# Altium project Genio350_DevKit.PrjPcb (part 3 of 3)

## Sheet AU.SchDoc
size A3; SheetNumber: 23; SheetTotal: 35
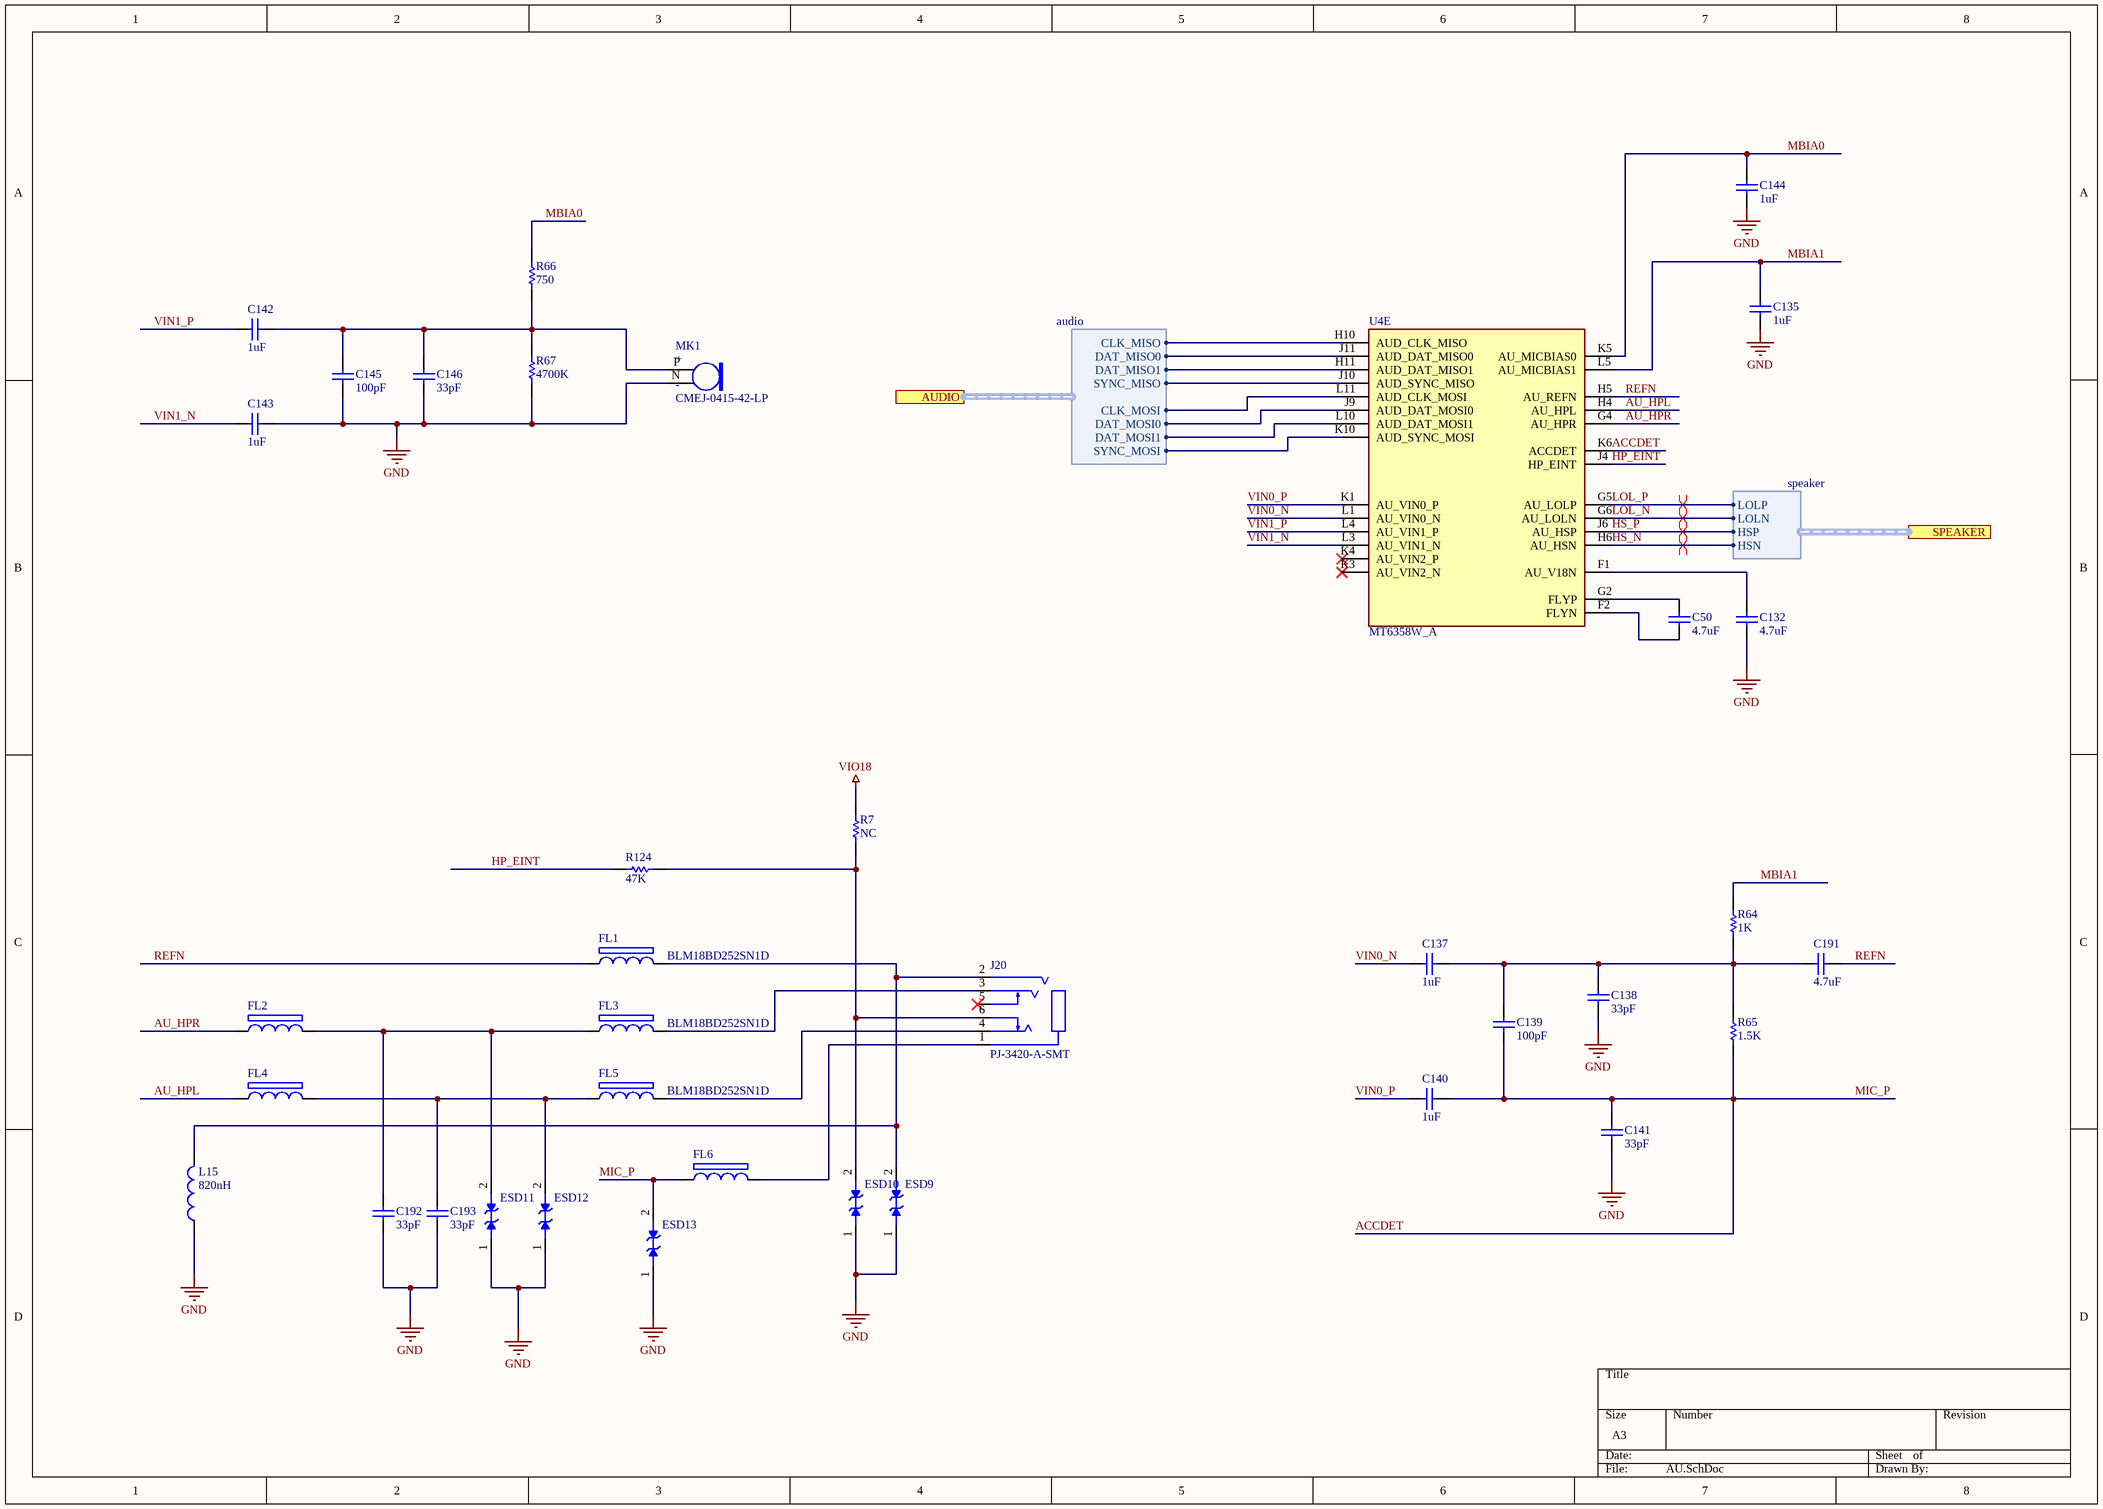
[diagram p25: AU.SchDoc]

### Parts
C50  value 4.7uF  [C0805]  (hidden comment: C0805)
C132  value 4.7uF  [C0805]  (hidden comment: C0805)
C135  value 1uF  [C0805]  (hidden comment: C0805)
C137  value 1uF  [C0805]  (hidden comment: C0805)
C138  value 33pF  [C0402]  (hidden comment: C0402)
C139  value 100pF  [C0402]  (hidden comment: C0402)
C140  value 1uF  [C0805]  (hidden comment: C0805)
C141  value 33pF  [C0402]  (hidden comment: C0402)
C142  value 1uF  [C0805]  (hidden comment: C0805)
C143  value 1uF  [C0805]  (hidden comment: C0805)
C144  value 1uF  [C0805]  (hidden comment: C0805)
C145  value 100pF  [C0402]  (hidden comment: C0402)
C146  value 33pF  [C0402]  (hidden comment: C0402)
C191  value 4.7uF  [C0805]  (hidden comment: C0805)
C192  value 33pF  [C0402]  (hidden comment: C0402)
C193  value 33pF  [C0402]  (hidden comment: C0402)
ESD9  ESD9B5.0ST5G  [SODFL1006X40N]  (value not drawn)
ESD10  ESD9B5.0ST5G  [SODFL1006X40N]  (value not drawn)
ESD11  ESD9B5.0ST5G  [SODFL1006X40N]  (value not drawn)
ESD12  ESD9B5.0ST5G  [SODFL1006X40N]  (value not drawn)
ESD13  ESD9B5.0ST5G  [SODFL1006X40N]  (value not drawn)
FL1  BLM18BD252SN1D  [BEADC1608X95N]
FL2  BLM18BD252SN1D  [BEADC1608X95N]  (value not drawn)
FL3  BLM18BD252SN1D  [BEADC1608X95N]
FL4  BLM18BD252SN1D  [BEADC1608X95N]  (value not drawn)
FL5  BLM18BD252SN1D  [BEADC1608X95N]
FL6  BLM18BD252SN1D  [BEADC1608X95N]  (value not drawn)
J20  PJ-3420-A-SMT  [PJ3420ASMT]
L15  value 820nH  [L0603]  (hidden comment: L0603)
MK1  CMEJ-0415-42-LP  [MIC_CMEJ-0415-42-LP]
R7  value NC  [R0603]  (hidden comment: R0603)
R64  value 1K  [R0603]  (hidden comment: R0603)
R65  value 1.5K  [R0603]  (hidden comment: R0603)
R66  value 750  [R0603]  (hidden comment: R0603)
R67  value 4700K  [R0603]  (hidden comment: R0603)
R124  value 47K  [R0603]  (hidden comment: R0603)
U4  MT6358W_A  [BGA194C40P16X15_640X600X66]  (part E of 6)

### Ports
AUDIO (harness audio, see Power[5400,5000], MT8365[10000,5800], MT8365_AUD[2500,6000], Power[5400,3900]), SPEAKER (harness speaker, see Power[5800,5000], AUDIO_AMP[397.796,3600], Power[5800,3800])

### Harnesses
audio: CLK_MISO, DAT_MISO0, DAT_MISO1, SYNC_MISO, CLK_MOSI, DAT_MOSI0, DAT_MOSI1, SYNC_MOSI
speaker: LOLP, LOLN, HSP, HSN

### Nets
GND: C132.2 C135.2 C138.1 C141.1 C143.1 C144.2 C145.1 C146.1 C192.1 C193.1 ESD9.1(A) ESD10.1(A) ESD11.1(A) ESD12.1(A) ESD13.1(A) L15.1 MK1.N(GND) R67.1
VIO18: R7.2
ACCDET: C139.1 C140.1 C141.2 ESD13.2(A1) FL6.1 R65.1 U4.K6(ACCDET)  [also labelled MIC_P]
AU_HPL: FL4.1 U4.H4(AU_HPL)
AU_HPR: FL2.1 U4.G4(AU_HPR)
HP_EINT: R124.1 U4.J4(HP_EINT)
HS_N: U4.H6(AU_HSN) ; port SPEAKER.HSN
HS_P: U4.J6(AU_HSP) ; port SPEAKER.HSP
LOL_N: U4.G6(AU_LOLN) ; port SPEAKER.LOLN
LOL_P: U4.G5(AU_LOLP) ; port SPEAKER.LOLP
MBIA0: C144.1 R66.2 U4.K5(AU_MICBIAS0)
MBIA1: C135.1 R64.2 U4.L5(AU_MICBIAS1)
REFN: C191.1 FL1.1 U4.H5(AU_REFN)
VIN0_N: C137.2 U4.L1(AU_VIN0_N)
VIN0_P: C140.2 U4.K1(AU_VIN0_P)
VIN1_N: C143.2 U4.L3(AU_VIN1_N)
VIN1_P: C142.2 U4.L4(AU_VIN1_P)
NetC50_1: C50.1 U4.G2(FLYP)
NetC50_2: C50.2 U4.F2(FLYN)
NetC132_1: C132.1 U4.F1(AU_V18N)
NetC137_1: C137.1 C138.2 C139.2 C191.2 R64.1 R65.2
NetC142_1: C142.1 C145.2 C146.2 MK1.P(OUTPUT) R66.1 R67.2
NetC192_2: C192.2 ESD11.2(A1) FL2.2 FL3.1
NetC193_2: C193.2 ESD12.2(A1) FL4.2 FL5.1
NetESD9_2: ESD9.2(A1) FL1.2 J20.2 L15.2
NetESD10_2: ESD10.2(A1) J20.6 R7.1 R124.2
NetFL3_2: FL3.2 J20.3
NetFL5_2: FL5.2 J20.4
NetFL6_2: FL6.2 J20.1
NetU1#1_AA26: U4.J9(AUD_DAT_MOSI0) ; port AUDIO.DAT_MOSI0
NetU1#1_AA29: U4.J10(AUD_SYNC_MISO) ; port AUDIO.SYNC_MISO
NetU1#1_AB29: U4.H11(AUD_DAT_MISO1) ; port AUDIO.DAT_MISO1
NetU1#1_W26: U4.L10(AUD_DAT_MOSI1) ; port AUDIO.DAT_MOSI1
NetU1#1_Y26: U4.L11(AUD_CLK_MOSI) ; port AUDIO.CLK_MOSI
NetU1#1_Y27: U4.K10(AUD_SYNC_MOSI) ; port AUDIO.SYNC_MOSI
NetU1#1_Y29: U4.J11(AUD_DAT_MISO0) ; port AUDIO.DAT_MISO0
NetU1#1_Y30: U4.H10(AUD_CLK_MISO) ; port AUDIO.CLK_MISO

Not connected (* = marked no-connect by the designer): J20 5(4)*; U4 K3(AU_VIN2_N)* K4(AU_VIN2_P)*

### Layout directives
differential pair: HS_N, HS_P, LOL_N, LOL_P

### Notes on the sheet
- (in symbol CMEJ-0415-42-LP) +; -

### Library data of the parts
ESD9-ESD13 = ESD9B5.0ST5G: as ESD5 on sheet UART
FL1-FL6 = BLM18BD252SN1D: Inductor Chip Bead 2.5KOhm 25% 100MHz Ferrite 50mA 0603
J20 = PJ-3420-A-SMT: Connector; Manufacturer_Name: XKB Connectivity; Datasheet Link: http://www.helloxkb.com/public/images/pdf/PJ-3420-X-SMT.pdf; Height: 4.5mm; Manufacturer_Part_Number: PJ-3420-A-SMT
MK1 = CMEJ-0415-42-LP: 4.0 mm, Omnidirectional, PCB Mount, 2.0 Vdc, Elecret Condenser Microphone
U4 = MT6358W_A: PMIC; Manufacturer_Name: Mediatek; Manufacturer_Part_Number: MT6358W/A; Datasheet Link: https://www.mouser.com/catalog/specsheets/MediaTek_MTK_MT6358_Product_Brief_v1_0.pdf?_gl=1*14yevt7*_ga*OTAyMjU2NDU3LjE2ODExMDUyMzk.*_ga_1KQLCYKRX3*MTcwODA1NjU3MS4xMTcuMC4xNzA4MDU2NTczLjAuMC4w*_ga_15W4STQT4T*MTcwODA1NjU3Mi4xNzIuMC4xNzA4MDU2NTczLjU5LjAuMA..; Height: 0.66mm; Mouser Part Number: 840-MT6358W/A; Mouser Price/Stock: https://www.mouser.co.uk/ProductDetail/MediaTek/MT6358W-A?qs=Jm2GQyTW%2FbiK3FZkyfX0lQ%3D%3D

## Sheet RTC_Miscellaneous.SchDoc
size A4; SheetNumber: 24; SheetTotal: 36
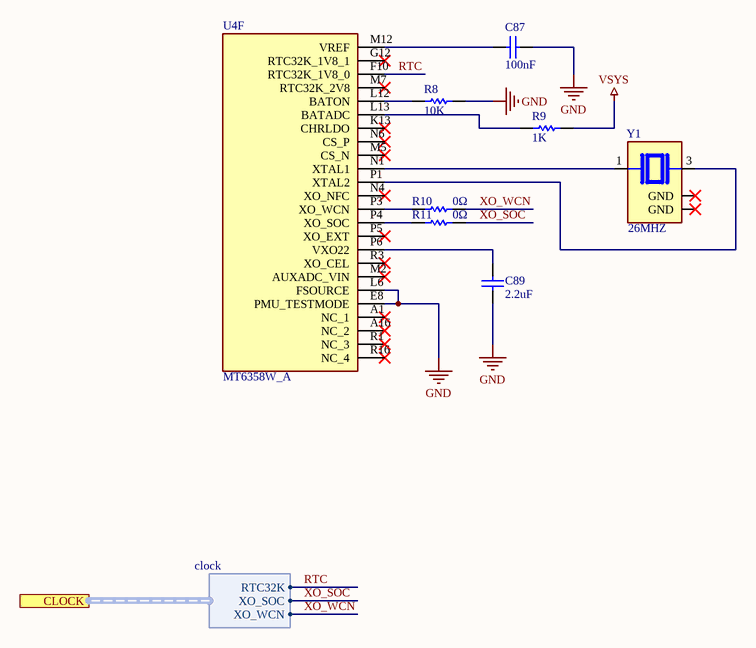
[diagram p26: RTC_Miscellaneous.SchDoc]

### Parts
C87  value 100nF  [C0603]  (hidden comment: C0603)
C89  value 2.2uF  [C0805]  (hidden comment: C0805)
R8  value 10K  [R0603]  (hidden comment: R0603)
R9  value 1K  [R0603]  (hidden comment: R0603)
R10  value 0Ω  [R0603]  (hidden comment: R0603)
R11  value 0Ω  [R0603]  (hidden comment: R0603)
U4  MT6358W_A  [BGA194C40P16X15_640X600X66]  (part F of 6)
Y1  26MHZ  [OSCCC320X250X90N]

### Ports
CLOCK (harness clock, see Power[10000,5700], MT8365[11000,4500], MT8365_Other[1500,5800], Power[11000,5700])

### Harnesses
clock: RTC32K, XO_SOC, XO_WCN

### Nets
GND: C87.1 C89.1 R8.2 U4.E8(PMU_TESTMODE) U4.L6(FSOURCE)
VSYS: R9.2
RTC: U4.F10(RTC32K_1V8_0) ; port CLOCK.RTC32K
XO_SOC: R11.2 ; port CLOCK.XO_SOC  [project net 26M_CLKSQ]
XO_WCN: R10.2 ; port CLOCK.XO_WCN  [project net XO_IN]
NetC87_2: C87.2 U4.M12(VREF)
NetC89_2: C89.2 U4.P6(VXO22)
NetR8_1: R8.1 U4.L12(BATON)
NetR9_1: R9.1 U4.L13(BATADC)
NetR10_1: R10.1 U4.P3(XO_WCN)
NetR11_1: R11.1 U4.P4(XO_SOC)
NetU4_N1: U4.N1(XTAL1) Y1.1
NetU4_P1: U4.P1(XTAL2) Y1.3

Not connected (* = marked no-connect by the designer): U4 A1(NC_1)* A16(NC_2)* G12(RTC32K_1V8_1)* K13(CHRLDO)* M2(AUXADC_VIN)* M5(CS_N)* M7(RTC32K_2V8)* N4(XO_NFC)* N6(CS_P)* P5(XO_EXT)* R1(NC_3)* R3(XO_CEL)* R16(NC_4)*; Y1 2(GND)* 4(GND)*

### Library data of the parts
U4 = MT6358W_A: as U4 on sheet AU; Datasheet Link: https://www.mouser.com/catalog/specsheets/MediaTek_MTK_MT6358_Product_Brief_v1_0.pdf?_gl=1*14yevt7*_ga*OTAyMjU2NDU3LjE2ODExMDUyMzk.*_ga_1KQLCYKRX3*MTcwODA1NjU3MS4xMTcuMC4xNzA4MDU2NTczLjAuMC4w*_ga_15W4STQT4T*MTcwODA1NjU3Mi4xNzIuMC4xNzA4MDU2NTczLjU5LjAuMA..; Height: 0.66mm; Mouser Part Number: 840-MT6358W/A; Mouser Price/Stock: https://www.mouser.co.uk/ProductDetail/MediaTek/MT6358W-A?qs=Jm2GQyTW%2FbiK3FZkyfX0lQ%3D%3D
Y1 = NX3225GA-26MHZ-TI

## Sheet Control_Interface.SchDoc
size A4; SheetNumber: 22; SheetTotal: 36
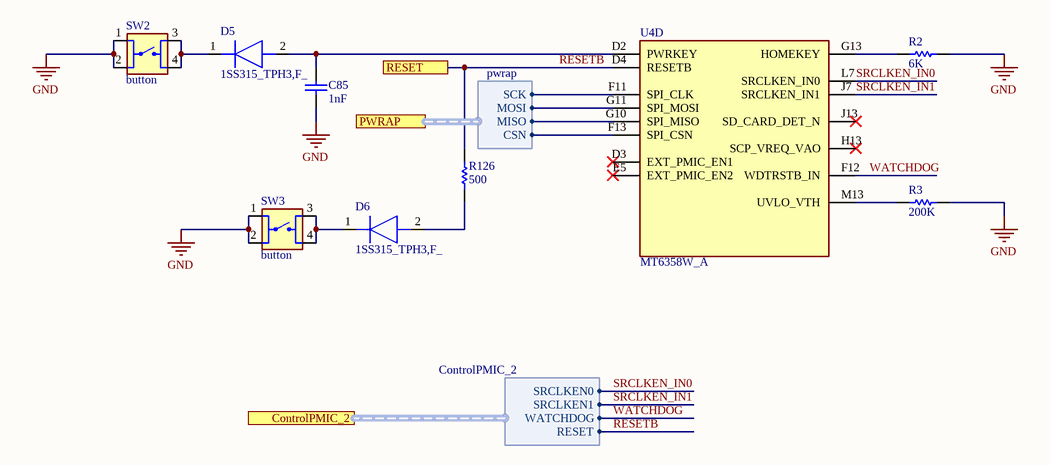
[diagram p27: Control_Interface.SchDoc]

### Parts
C85  value 1nF  [C0603]  (hidden comment: C0603)
D5  1SS315_TPH3,F_  [SOD2513X110N]
D6  1SS315_TPH3,F_  [SOD2513X110N]
R2  value 6K  [R0603]  (hidden comment: R0603)
R3  value 200K  [R0603]  (hidden comment: R0603)
R126  value 500  [R0603]  (hidden comment: R0603)
SW2  button  [BUTTON]
SW3  button  [BUTTON]
U4  MT6358W_A  [BGA194C40P16X15_640X600X66]  (part D of 6)

### Ports
ControlPMIC_2 (harness ControlPMIC_2, see Power[9700,8000], MT8365[11000,4800], MT8365_Other[1000,3700], Power[9700,9000]), PWRAP (harness pwrap, see Power[9100,8000], MT8365[5500,9000], MT8365_CONN[4500,8700], Power[9100,9000]), RESET (see Power[10000,7100], Power[11300,7100], RTL8201F[12800,5800], UART[1500,3000])

### Harnesses
pwrap: SCK, MOSI, MISO, CSN
ControlPMIC_2: WATCHDOG, SRCLKEN0, SRCLKEN1, RESET

### Nets
GND: C85.1 R2.2 R3.2 SW2.1 SW2.2 SW3.1 SW3.2
RESETB: R126.2 U4.D4(RESETB) ; port RESET, port ControlPMIC_2.RESET  [project net reset]
SRCLKEN_IN0: U4.L7(SRCLKEN_IN0) ; port ControlPMIC_2.SRCLKEN0
SRCLKEN_IN1: U4.J7(SRCLKEN_IN1) ; port ControlPMIC_2.SRCLKEN1
WATCHDOG: U4.F12(WDTRSTB_IN) ; port ControlPMIC_2.WATCHDOG
NetC85_2: C85.2 D5.2(A) U4.D2(PWRKEY)
NetD5_1: D5.1(K) SW2.3 SW2.4
NetD6_1: D6.1(K) SW3.3 SW3.4
NetD6_2: D6.2(A) R126.1
NetR2_1: R2.1 U4.G13(HOMEKEY)
NetR3_1: R3.1 U4.M13(UVLO_VTH)
NetU1#2_AC27: U4.G10(SPI_MISO) ; port PWRAP.MISO
NetU1#2_AD27: U4.F11(SPI_CLK) ; port PWRAP.SCK
NetU1#2_AD28: U4.F13(SPI_CSN) ; port PWRAP.CSN
NetU1#2_AE28: U4.G11(SPI_MOSI) ; port PWRAP.MOSI

Not connected (* = marked no-connect by the designer): U4 D3(EXT_PMIC_EN1)* E5(EXT_PMIC_EN2)* H13(SCP_VREQ_VAO)* J13(SD_CARD_DET_N)*

### Library data of the parts
D5 D6 = 1SS315_TPH3,F_: Diode; Manufacturer_Name: Toshiba; Manufacturer_Part_Number: 1SS315(TPH3,F); Height: 1.1mm; Mouser Part Number: N/A; Mouser Price/Stock: https://www.mouser.co.uk/ProductDetail/Toshiba/1SS315TPH3F?qs=8TQFHmocP6xxNvZUFM2DpA%3D%3D
SW2 SW3 = button: 6x6 mm
U4 = MT6358W_A: Integrated Circuit; Manufacturer_Name: Mediatek; Manufacturer_Part_Number: MT6358W/A; Datasheet Link: https://www.mouser.com/catalog/specsheets/MediaTek_MTK_MT6358_Product_Brief_v1_0.pdf?_gl=1*14yevt7*_ga*OTAyMjU2NDU3LjE2ODExMDUyMzk.*_ga_1KQLCYKRX3*MTcwODA1NjU3MS4xMTcuMC4xNzA4MDU2NTczLjAuMC4w*_ga_15W4STQT4T*MTcwODA1NjU3Mi4xNzIuMC4xNzA4MDU2NTczLjU5LjAuMA..; Height: 0.66mm; Mouser Part Number: 840-MT6358W/A; Mouser Price/Stock: https://www.mouser.co.uk/ProductDetail/MediaTek/MT6358W-A?qs=Jm2GQyTW%2FbiK3FZkyfX0lQ%3D%3D

## Sheet Charger_boost_LDO.SchDoc
size A3; SheetNumber: 25; SheetTotal: 35
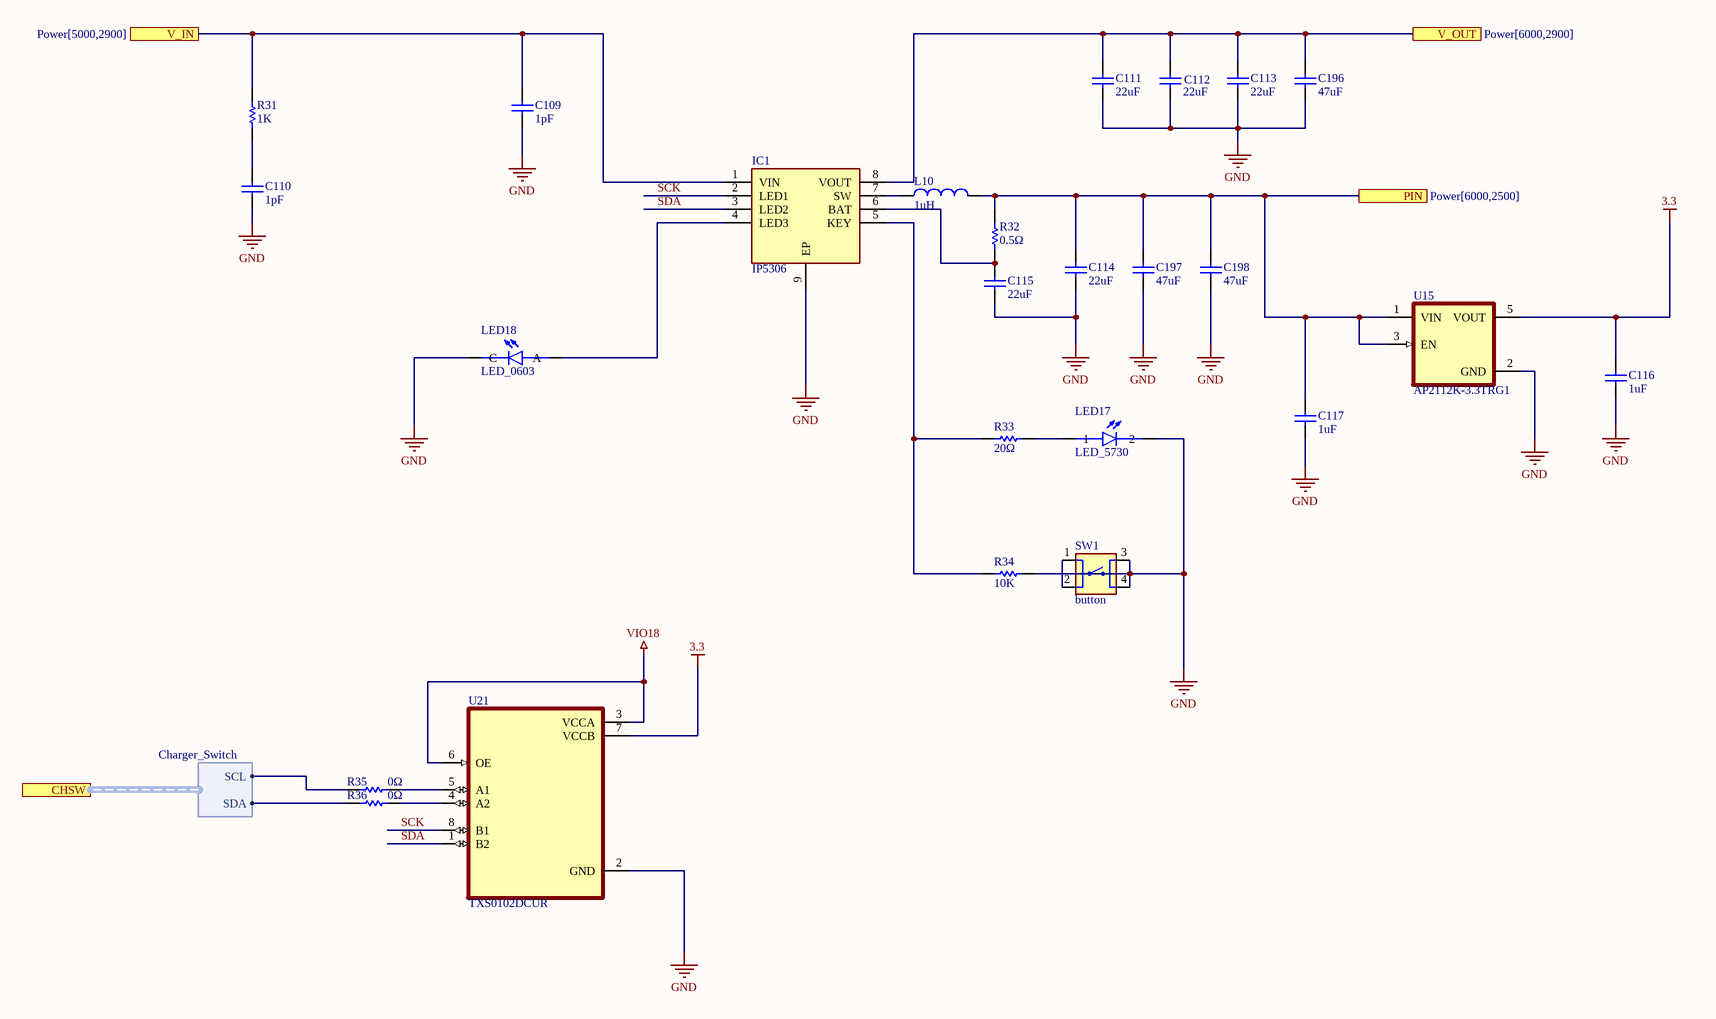
[diagram p28: Charger_boost_LDO.SchDoc]

### Parts
C109  value 1pF  [C0402]  (hidden comment: C0402)
C110  value 1pF  [C0402]  (hidden comment: C0402)
C111  value 22uF  [C1210]  (hidden comment: C1210)
C112  value 22uF  [C1210]  (hidden comment: C1210)
C113  value 22uF  [C1210]  (hidden comment: C1210)
C114  value 22uF  [C1210]  (hidden comment: C1210)
C115  value 22uF  [C1210]  (hidden comment: C1210)
C116  value 1uF  [C0805]  (hidden comment: C0805)
C117  value 1uF  [C0805]  (hidden comment: C0805)
C196  value 47uF  [C1812]  (hidden comment: C1812)
C197  value 47uF  [C1812]  (hidden comment: C1812)
C198  value 47uF  [C1812]  (hidden comment: C1812)
IC1  IP5306  [SOIC127P600X165-9N]
L10  value 1uH  [L0806]  (hidden comment: L0806)
LED17  LED_5730  [SM5730UWDC05]
LED18  LED_0603  [LED_0603]
R31  value 1K  [R0603]  (hidden comment: R0603)
R32  value 0.5Ω  [R1210]  (hidden comment: R1210)
R33  value 20Ω  [R1206]  (hidden comment: R1206)
R34  value 10K  [R0603]  (hidden comment: R0603)
R35  value 0Ω  [R0603]  (hidden comment: R0603)
R36  value 0Ω  [R0603]  (hidden comment: R0603)
SW1  button  [BUTTON]
U15  AP2112K-3.3TRG1  [SOT95P285X140-5N]
U21  TXS0102DCUR  [SOP50P310X90-8N]

### Ports
CHSW (harness Charger_Switch, see Power[5300,2200], I2C_Switch[500,7800], Power[5300,500]), PIN (see Power[6000,2500]), V_IN (see Power[5000,2900]), V_OUT (see Power[6000,2900])

### Harnesses
Charger_Switch: SCL, SDA

### Nets
3.3: C116.2 U15.5(VOUT) U21.7(VCCB)
+5: C111.2 C112.2 C113.2 C196.2 IC1.8(VOUT) ; port V_OUT
GND: C109.1 C110.1 C111.1 C112.1 C113.1 C114.1 C115.1 C116.1 C117.1 C196.1 C197.1 C198.1 IC1.9(EP) LED17.2 LED18.C R34.2 SW1.3 SW1.4 U15.2(GND) U21.2(GND)
VIO18: U21.3(VCCA) U21.6(OE)
VSYS: C114.2 C117.2 C197.2 C198.2 L10.2 R32.2 U15.1(VIN) U15.3(EN) ; port PIN
SCK: IC1.2(LED1) U21.8(B1)
SDA: IC1.3(LED2) U21.1(B2)
NetC109_2: C109.2 IC1.1(VIN) R31.2 ; port V_IN
NetC110_2: C110.2 R31.1
NetC115_2: C115.2 IC1.6(BAT) R32.1
NetIC1_4: IC1.4(LED3) LED18.A
NetIC1_5: IC1.5(KEY) R33.1 R34.1
NetIC1_7: IC1.7(SW) L10.1
NetLED17_1: LED17.1 R33.2
NetR35_1: R35.1 ; port CHSW.SCL
NetR35_2: R35.2 U21.5(A1)
NetR36_1: R36.1 ; port CHSW.SDA
NetR36_2: R36.2 U21.4(A2)
NetSW1_1: SW1.1 SW1.2

### Library data of the parts
IC1 = IP5306: Integrated Circuit; Manufacturer_Name: INJOINIC; Datasheet Link: https://datasheetspdf.com/pdf-file/1139129/Injoinic/IP5306/1; Height: 1.65mm; Manufacturer_Part_Number: IP5306
L10 = L0806: Inductor / SMD:1.6x2mm
LED17 = LED_5730: LED SMD; Manufacturer_Name: Bivar; Datasheet Link: https://ja-bots.com/wp-content/uploads/2023/01/SM5730UWDC05-BIVAR.pdf?srsltid=AfmBOoovMyML2SIj8QvW33aYphKHuiK9c7G9KYdJdHNR0r_sEcANN2ud; Height: 1.154mm; Manufacturer_Part_Number: SM5730UWDC05; Mouser Part Number: 749-SM5730UWDC05; Mouser Price/Stock: https://www.mouser.co.uk/ProductDetail/Bivar/SM5730UWDC05?qs=R6DaRWE8nmu0EcNcbYsDPw%3D%3D; Arrow Part Number: SM5730UWDC05; Arrow Price/Stock: https://www.arrow.com/en/products/sm5730uwdc05/bivar?region=nac
LED18 = LED_0603: LED SMD
SW1 = button: 6x6 mm
U15 = AP2112K-3.3TRG1: Linear Voltage Regulator IC Positive Fixed 1 Output 600mA SOT-25
U21 = TXS0102DCUR: chuyển mức tín hiệu I2C

## Sheet Camera.SchDoc
size A3; Author: Nguyễn Hữu Thắng; DrawnBy: Nguyễn Hữu Thắng; SheetNumber: 30; SheetTotal: 35
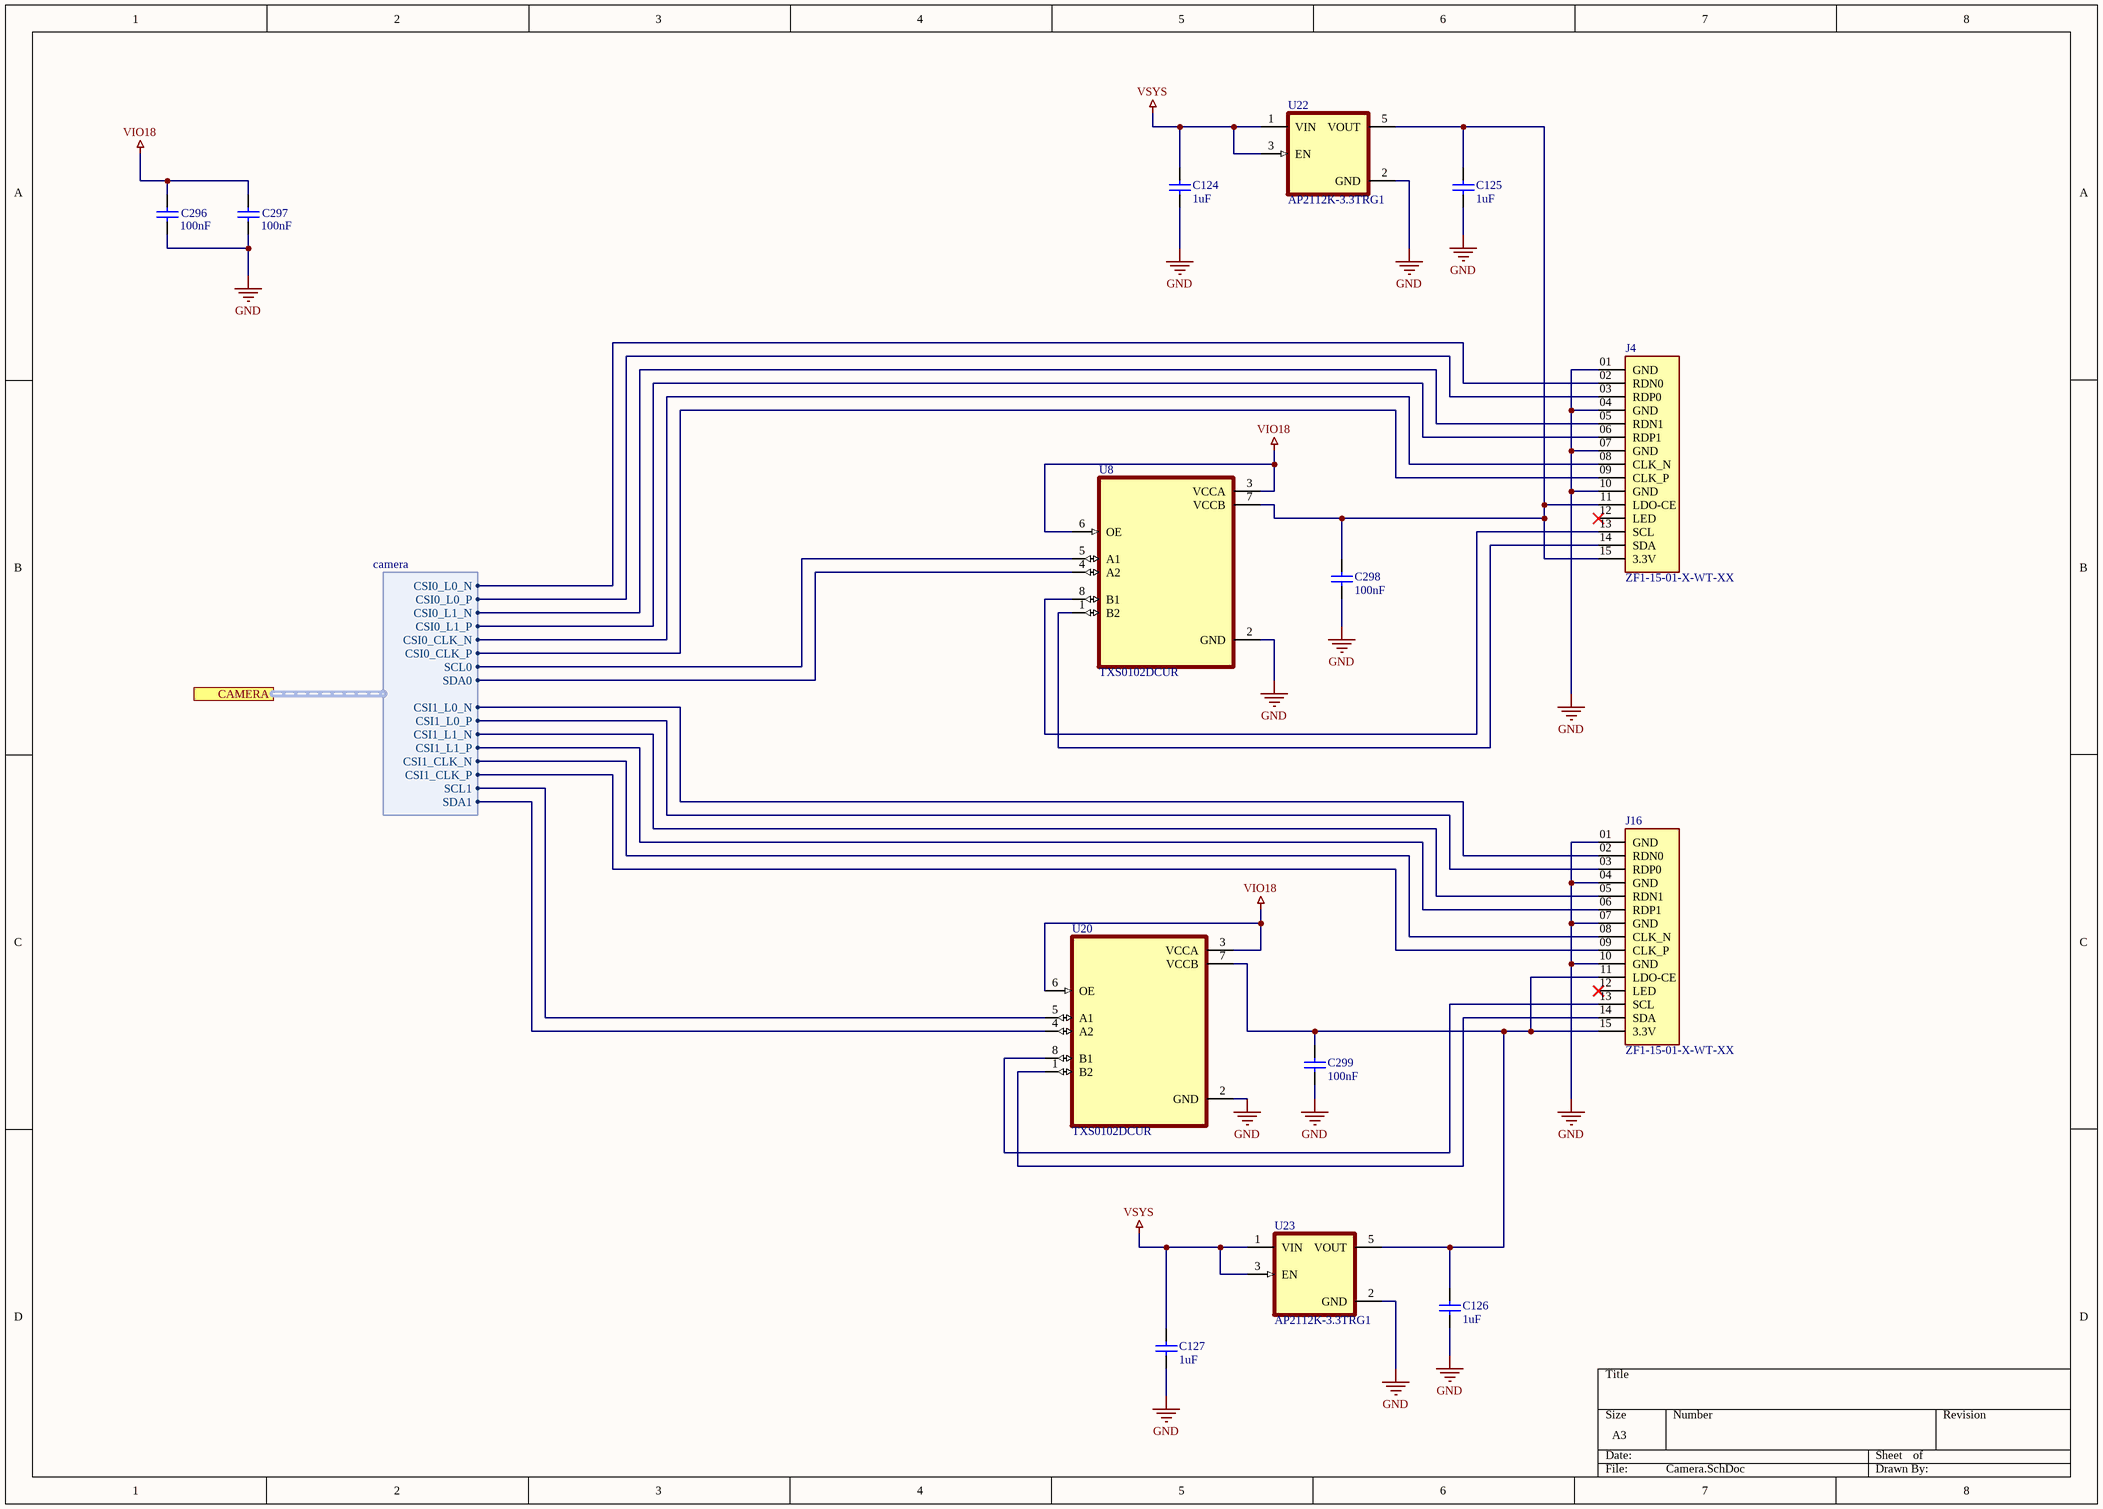
[diagram p29: Camera.SchDoc]

### Parts
C124  value 1uF  [C0805]  (hidden comment: C0805)
C125  value 1uF  [C0805]  (hidden comment: C0805)
C126  value 1uF  [C0805]  (hidden comment: C0805)
C127  value 1uF  [C0805]  (hidden comment: C0805)
C296  value 100nF  [C0603]  (hidden comment: C0603)
C297  value 100nF  [C0603]  (hidden comment: C0603)
C298  value 100nF  [C0603]  (hidden comment: C0603)
C299  value 100nF  [C0603]  (hidden comment: C0603)
J4  ZF1-15-01-X-WT-XX  [SAMTEC_ZF1-15-01-X-WT-XX]
J16  ZF1-15-01-X-WT-XX  [SAMTEC_ZF1-15-01-X-WT-XX]
U8  TXS0102DCUR  [SOP50P310X90-8N]
U20  TXS0102DCUR  [SOP50P310X90-8N]
U22  AP2112K-3.3TRG1  [SOT95P285X140-5N]
U23  AP2112K-3.3TRG1  [SOT95P285X140-5N]

### Ports
CAMERA (harness camera, see main[4000,5400], MT8365[10400,6600], MT8365_Camera[2400,4000])

### Harnesses
camera: CSI0_L0_P, CSI0_L0_N, CSI0_L1_P, CSI0_L1_N, CSI0_CLK_P, CSI0_CLK_N, CSI1_L0_P, CSI1_L0_N, CSI1_L1_P, CSI1_L1_N, CSI1_CLK_P, CSI1_CLK_N, SCL0, SDA0, SCL1, SDA1

### Nets
GND: C124.1 C125.1 C126.1 C127.1 C296.1 C297.1 C298.1 C299.1 J4.01(GND) J4.04(GND) J4.07(GND) J4.10(GND) J16.01(GND) J16.04(GND) J16.07(GND) J16.10(GND) U8.2(GND) U20.2(GND) U22.2(GND) U23.2(GND)
VIO18: C296.2 C297.2 U8.3(VCCA) U8.6(OE) U20.3(VCCA) U20.6(OE)
VSYS: C124.2 C127.2 U22.1(VIN) U22.3(EN) U23.1(VIN) U23.3(EN)
27: U20.4(A2) ; port CAMERA.SDA1
28: U20.5(A1) ; port CAMERA.SCL1
CSI0_CLK_N: J4.08(CLK_N) ; port CAMERA.CSI0_CLK_N
CSI0_CLK_P: J4.09(CLK_P) ; port CAMERA.CSI0_CLK_P
CSI0_L0_N: J4.02(RDN0) ; port CAMERA.CSI0_L0_N
CSI0_L0_P: J4.03(RDP0) ; port CAMERA.CSI0_L0_P
CSI0_L1_N: J4.05(RDN1) ; port CAMERA.CSI0_L1_N
CSI0_L1_P: J4.06(RDP1) ; port CAMERA.CSI0_L1_P
CSI1_CLK_N: J16.08(CLK_N) ; port CAMERA.CSI1_CLK_N
CSI1_CLK_P: J16.09(CLK_P) ; port CAMERA.CSI1_CLK_P
CSI1_L0_N: J16.02(RDN0) ; port CAMERA.CSI1_L0_N
CSI1_L0_P: J16.03(RDP0) ; port CAMERA.CSI1_L0_P
CSI1_L1_N: J16.05(RDN1) ; port CAMERA.CSI1_L1_N
CSI1_L1_P: J16.06(RDP1) ; port CAMERA.CSI1_L1_P
NetC125_2: C125.2 C298.2 J4.11(LDO-CE) J4.15(3.3V) U8.7(VCCB) U22.5(VOUT)
NetC126_2: C126.2 C299.2 J16.11(LDO-CE) J16.15(3.3V) U20.7(VCCB) U23.5(VOUT)
NetJ4_13: J4.13(SCL) U8.8(B1)
NetJ4_14: J4.14(SDA) U8.1(B2)
NetJ16_13: J16.13(SCL) U20.8(B1)
NetJ16_14: J16.14(SDA) U20.1(B2)
NetU1#2_AH4: U8.5(A1) ; port CAMERA.SCL0
NetU1#2_AJ4: U8.4(A2) ; port CAMERA.SDA0

Not connected (* = marked no-connect by the designer): J4 12(LED)*; J16 12(LED)*

### Library data of the parts
U22 U23 = AP2112K-3.3TRG1: as U15 on sheet Charger_boost_LDO

## Sheet USB.SchDoc
size A4; Author: Nguyễn Hữu Thắng; DrawnBy: Nguyễn Hữu Thắng; SheetNumber: 28; SheetTotal: 36
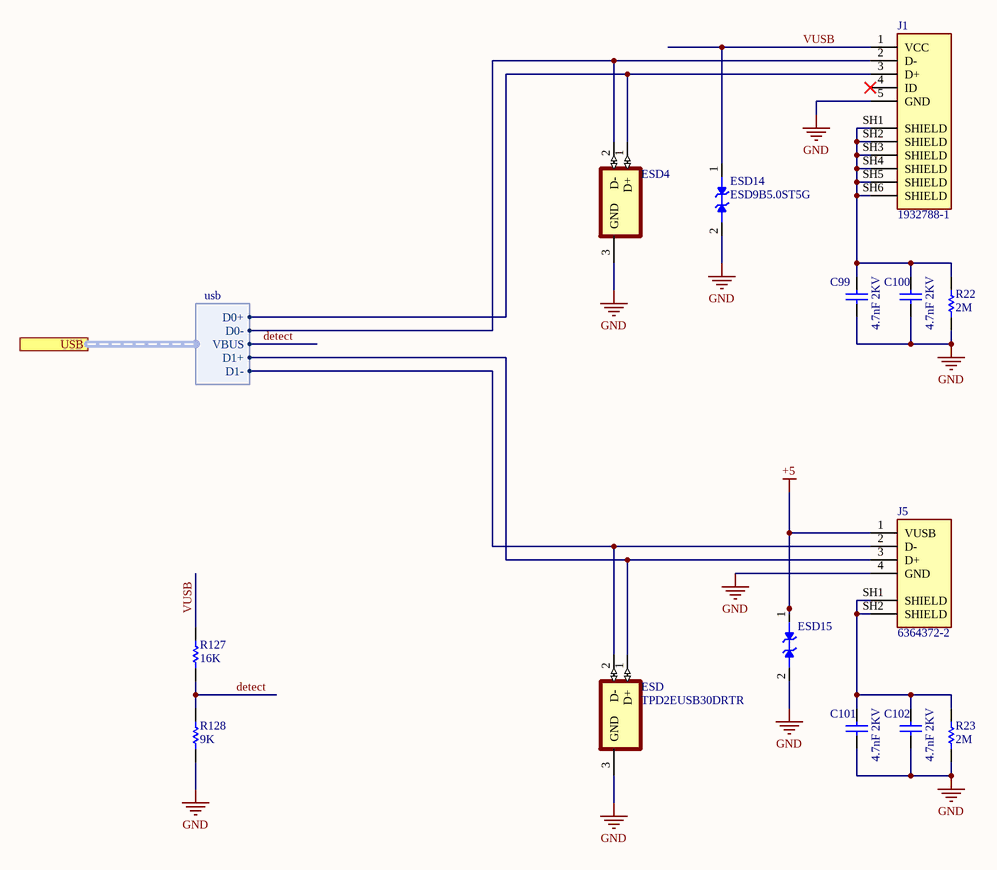
[diagram p30: USB.SchDoc]

### Parts
C99  value 4.7nF 2KV  [C1210]  (hidden comment: C1210)
C100  value 4.7nF 2KV  [C1210]  (hidden comment: C1210)
C101  value 4.7nF 2KV  [C1210]  (hidden comment: C1210)
C102  value 4.7nF 2KV  [C1210]  (hidden comment: C1210)
ESD  TPD2EUSB30DRTR  [SOTFL35P100X50-3N]
ESD4  TPD2EUSB30DRTR  [SOTFL35P100X50-3N]  (value not drawn)
ESD14  ESD9B5.0ST5G  [SODFL1006X40N]
ESD15  ESD9B5.0ST5G  [SODFL1006X40N]  (value not drawn)
J1  1932788-1  [TE_1932788-1]
J5  6364372-2  [TE_6364372-2]
R22  value 2M  [R0603]  (hidden comment: R0603)
R23  value 2M  [R0603]  (hidden comment: R0603)
R127  value 16K  [R0603]  (hidden comment: R0603)
R128  value 9K  [R0603]  (hidden comment: R0603)

### Ports
USB (harness usb, see main[9000,4700], MT8365[6600,9000], MT8365_CONN[2500,5900])

### Harnesses
usb: D0+, D0-, D1+, D1-, VBUS

### Nets
+5: ESD15.1(A) J5.1(VUSB)
GND: C99.1 C100.1 C101.1 C102.1 ESD.3(GND) ESD4.3(GND) ESD14.2(A1) ESD15.2(A1) J1.5(GND) J5.4(GND) R22.2 R23.2 R128.1
detect: R127.1 R128.2 ; port USB.VBUS
USB0_N: ESD4.2(D-) J1.2(D-) ; port USB.D0-
USB0_P: ESD4.1(D+) J1.3(D+) ; port USB.D0+
USB1_N: ESD.2(D-) J5.2(D-) ; port USB.D1-
USB1_P: ESD.1(D+) J5.3(D+) ; port USB.D1+
VUSB: ESD14.1(A) J1.1(VCC) R127.2
NetC99_2: C99.2 C100.2 J1.SH1(SHIELD) J1.SH2(SHIELD) J1.SH3(SHIELD) J1.SH4(SHIELD) J1.SH5(SHIELD) J1.SH6(SHIELD) R22.1
NetC101_2: C101.2 C102.2 J5.SH1(SHIELD) J5.SH2(SHIELD) R23.1

Not connected (* = marked no-connect by the designer): J1 4(ID)*

### Library data of the parts
ESD ESD4 = TPD2EUSB30DRTR: 2-channel ESD solution for SuperSpeed USB 3.0 interface 3-SOT-9X3 -40 to 85
ESD14 ESD15 = ESD9B5.0ST5G: Clamp Ipp Tvs Diode Surface Mount SOD-923

## Sheet GPIOs.SchDoc
size A3; Author: Nguyễn Hữu Thắng; DrawnBy: Nguyễn Hữu Thắng; SheetNumber: 32; SheetTotal: 35
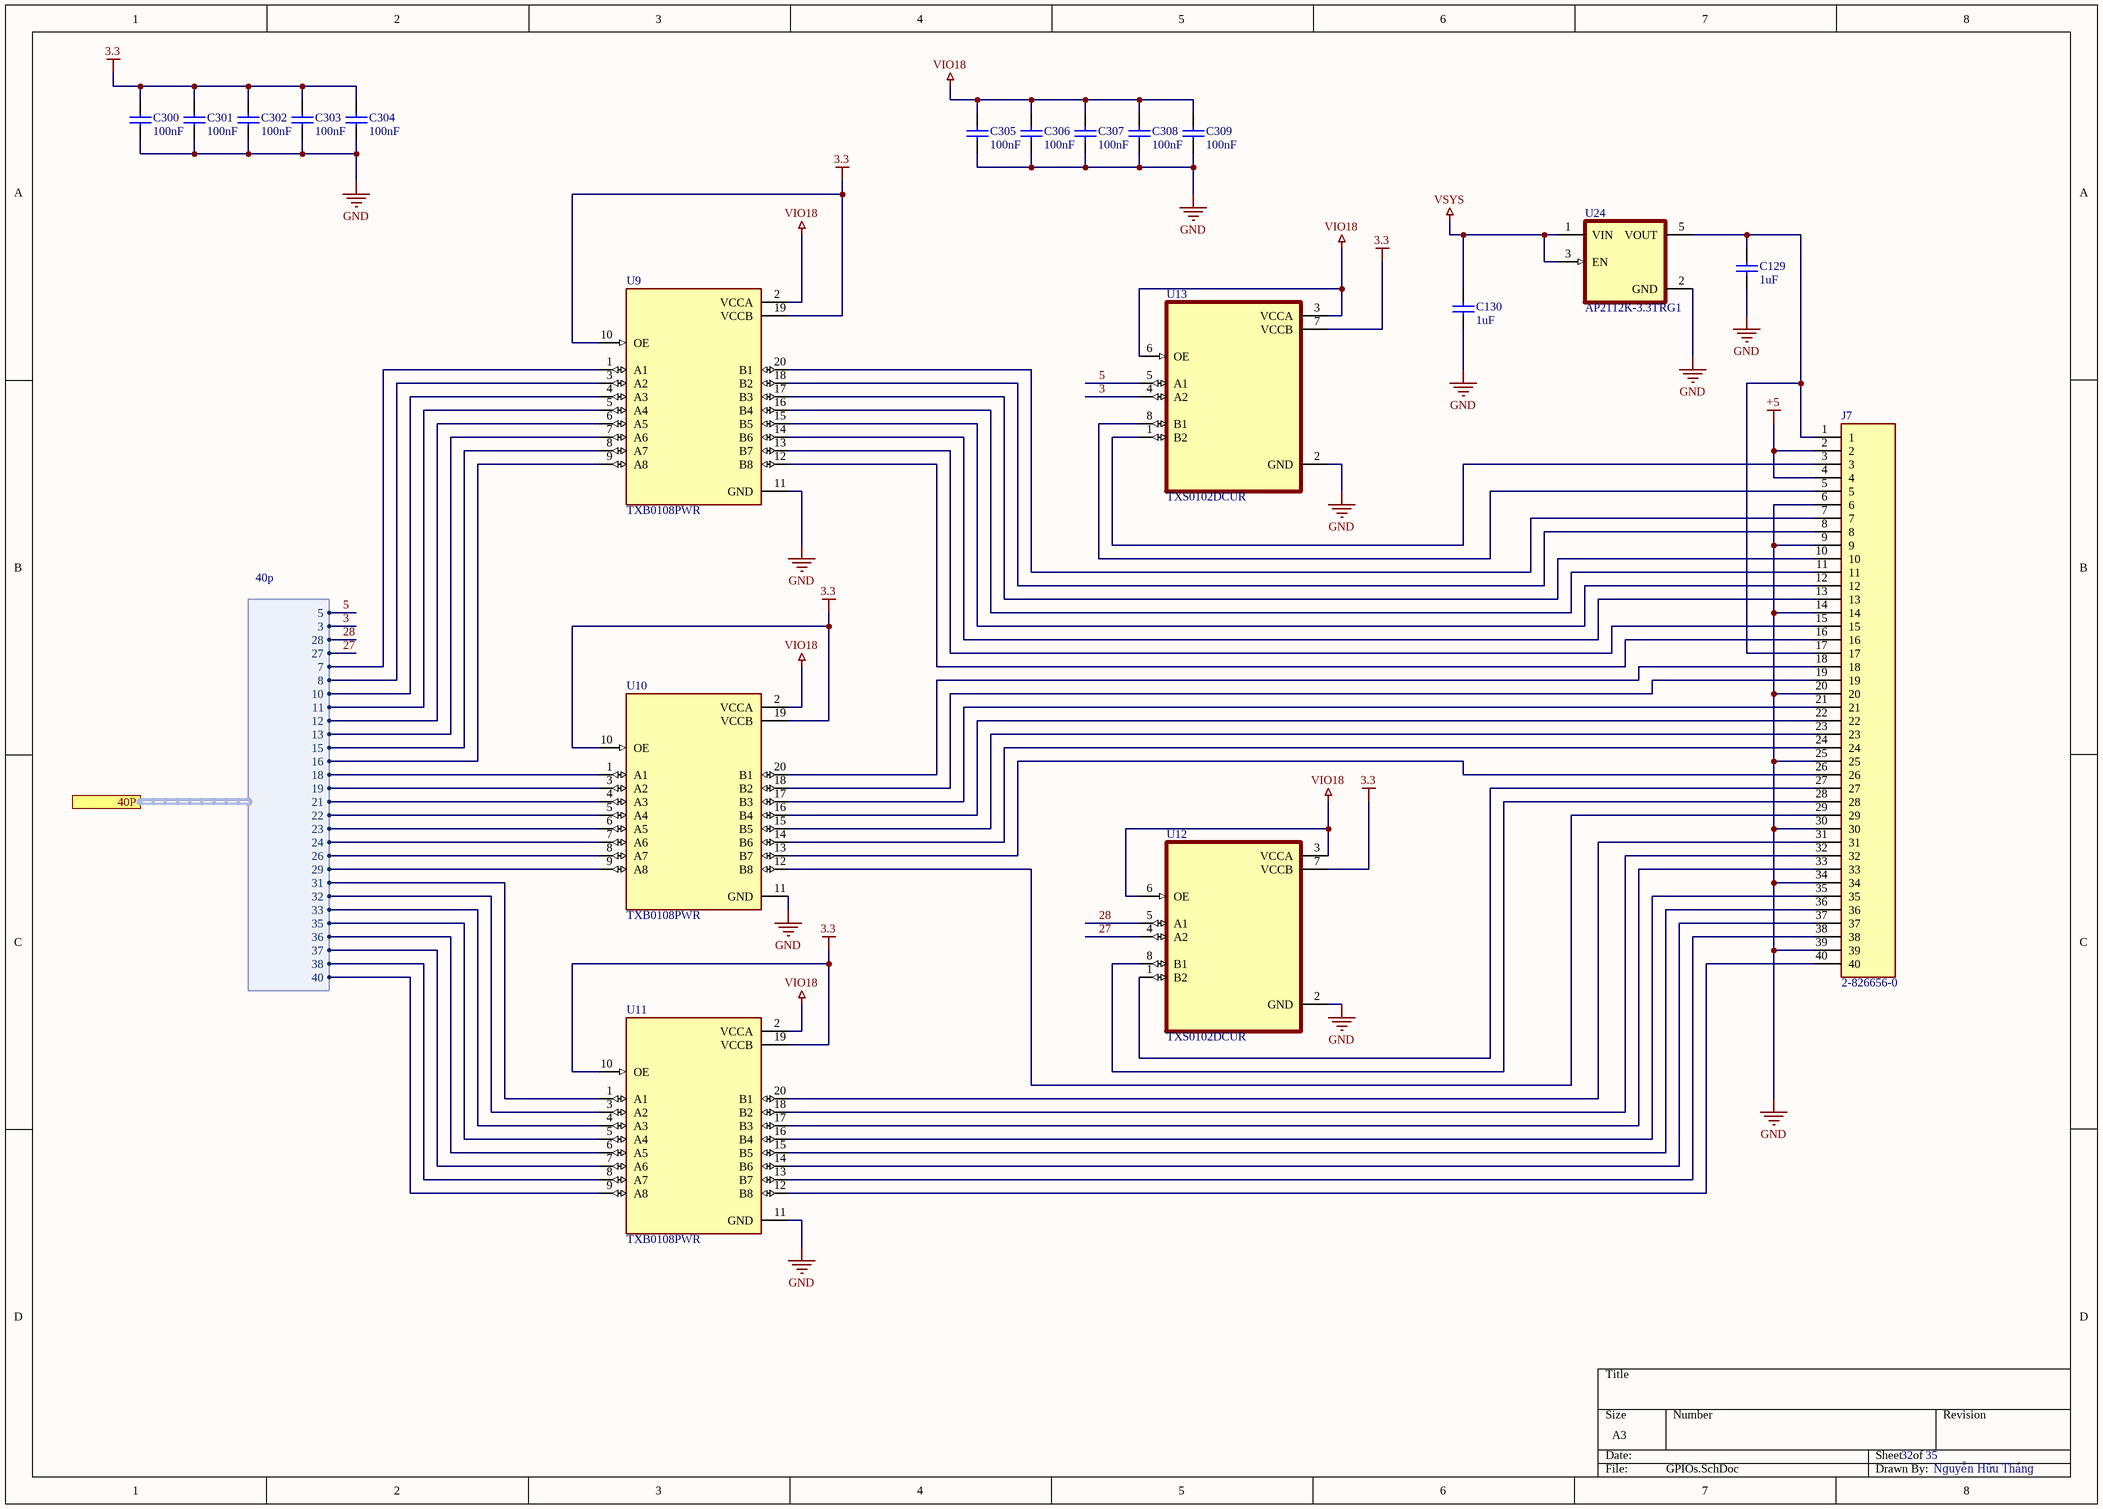
[diagram p31: GPIOs.SchDoc]

### Parts
C129  value 1uF  [C0805]  (hidden comment: C0805)
C130  value 1uF  [C0805]  (hidden comment: C0805)
C300  value 100nF  [C0603]  (hidden comment: C0603)
C301  value 100nF  [C0603]  (hidden comment: C0603)
C302  value 100nF  [C0603]  (hidden comment: C0603)
C303  value 100nF  [C0603]  (hidden comment: C0603)
C304  value 100nF  [C0603]  (hidden comment: C0603)
C305  value 100nF  [C0603]  (hidden comment: C0603)
C306  value 100nF  [C0603]  (hidden comment: C0603)
C307  value 100nF  [C0603]  (hidden comment: C0603)
C308  value 100nF  [C0603]  (hidden comment: C0603)
C309  value 100nF  [C0603]  (hidden comment: C0603)
J7  2-826656-0  [TE_2-826656-0]
U9  TXB0108PWR  [SOP65P640X120-20N]
U10  TXB0108PWR  [SOP65P640X120-20N]
U11  TXB0108PWR  [SOP65P640X120-20N]
U12  TXS0102DCUR  [SOP50P310X90-8N]
U13  TXS0102DCUR  [SOP50P310X90-8N]
U24  AP2112K-3.3TRG1  [SOT95P285X140-5N]

### Ports
40P (harness 40p, see main[6000,4000], MT8365[4600,3000], MT8365[7500,8900], MT8365[10000,5500], MT8365_AUD[3500,5200], MT8365_CONN[10500,3000], MT8365_eMMC[8900,5600])

### Harnesses
40p: 7, 8, 10, 11, 12, 13, 15, 16, 18, 19, 21, 22, 23, 24, 26, 29, 32, 35, 36, 37, 38, 40, 33, 31, 5, 3, 28, 27

### Nets
3.3: C300.2 C301.2 C302.2 C303.2 C304.2 U9.10(OE) U9.19(VCCB) U10.10(OE) U10.19(VCCB) U11.10(OE) U11.19(VCCB) U12.7(VCCB) U13.7(VCCB)
+5: J7.2 J7.4
GND: C129.1 C130.1 C300.1 C301.1 C302.1 C303.1 C304.1 C305.1 C306.1 C307.1 C308.1 C309.1 J7.6 J7.9 J7.14 J7.20 J7.25 J7.30 J7.34 J7.39 U9.11(GND) U10.11(GND) U11.11(GND) U12.2(GND) U13.2(GND) U24.2(GND)
VIO18: C305.2 C306.2 C307.2 C308.2 C309.2 U9.2(VCCA) U10.2(VCCA) U11.2(VCCA) U12.3(VCCA) U12.6(OE) U13.3(VCCA) U13.6(OE)
VSYS: C130.2 U24.1(VIN) U24.3(EN)
3: U13.4(A2) ; port 40P.3
5: U13.5(A1) ; port 40P.5
27: U12.4(A2) ; port 40P.27
28: U12.5(A1) ; port 40P.28
CK: U10.6(A5) ; port 40P.23
CS: U10.7(A6) ; port 40P.24
GPIO10: U9.1(A1) ; port 40P.7
GPIO13: U9.5(A4) ; port 40P.11
KPCOL0: U10.8(A7) ; port 40P.26
KPCOL1: U10.9(A8) ; port 40P.29
KPROW0: U11.6(A5) ; port 40P.36
KPROW1: U11.7(A6) ; port 40P.37
MI: U10.4(A3) ; port 40P.21
MO: U10.3(A2) ; port 40P.19
PWM_C: U11.3(A2) ; port 40P.32
URXD2: U9.4(A3) ; port 40P.10
UTXD2: U9.3(A2) ; port 40P.8
NetC129_2: C129.2 J7.1 J7.17 U24.5(VOUT)
NetJ7_3: J7.3 U13.1(B2)
NetJ7_5: J7.5 U13.8(B1)
NetJ7_7: J7.7 U9.20(B1)
NetJ7_8: J7.8 U9.18(B2)
NetJ7_10: J7.10 U9.17(B3)
NetJ7_11: J7.11 U9.16(B4)
NetJ7_12: J7.12 U9.15(B5)
NetJ7_13: J7.13 U9.14(B6)
NetJ7_15: J7.15 U9.13(B7)
NetJ7_16: J7.16 U9.12(B8)
NetJ7_18: J7.18 U10.20(B1)
NetJ7_19: J7.19 U10.18(B2)
NetJ7_21: J7.21 U10.17(B3)
NetJ7_22: J7.22 U10.16(B4)
NetJ7_23: J7.23 U10.15(B5)
NetJ7_24: J7.24 U10.14(B6)
NetJ7_26: J7.26 U10.13(B7)
NetJ7_27: J7.27 U12.1(B2)
NetJ7_28: J7.28 U12.8(B1)
NetJ7_29: J7.29 U10.12(B8)
NetJ7_31: J7.31 U11.20(B1)
NetJ7_32: J7.32 U11.18(B2)
NetJ7_33: J7.33 U11.17(B3)
NetJ7_35: J7.35 U11.16(B4)
NetJ7_36: J7.36 U11.15(B5)
NetJ7_37: J7.37 U11.14(B6)
NetJ7_38: J7.38 U11.13(B7)
NetJ7_40: J7.40 U11.12(B8)
NetU1#1_AB13: U9.6(A5) ; port 40P.12
NetU1#1_AB14: U11.5(A4) ; port 40P.35
NetU1#1_AC14: U11.9(A8) ; port 40P.40
NetU1#1_AD14: U11.8(A7) ; port 40P.38
NetU1#2_AC13: U11.4(A3) ; port 40P.33
NetU1#2_AD13: U9.9(A8) ; port 40P.16
NetU1#2_AE13: U10.5(A4) ; port 40P.22
NetU1#2_AE14: U11.1(A1) ; port 40P.31
NetU1#2_AF12: U10.1(A1) ; port 40P.18
NetU1#2_AF13: U9.8(A7) ; port 40P.15
NetU1#2_AF14: U9.7(A6) ; port 40P.13

### Library data of the parts
U24 = AP2112K-3.3TRG1: Linear Voltage Regulator IC Positive Fixed 1 Output 600mA SOT-25

## Sheet Display.SchDoc
size A4; SheetNumber: 33; SheetTotal: 36
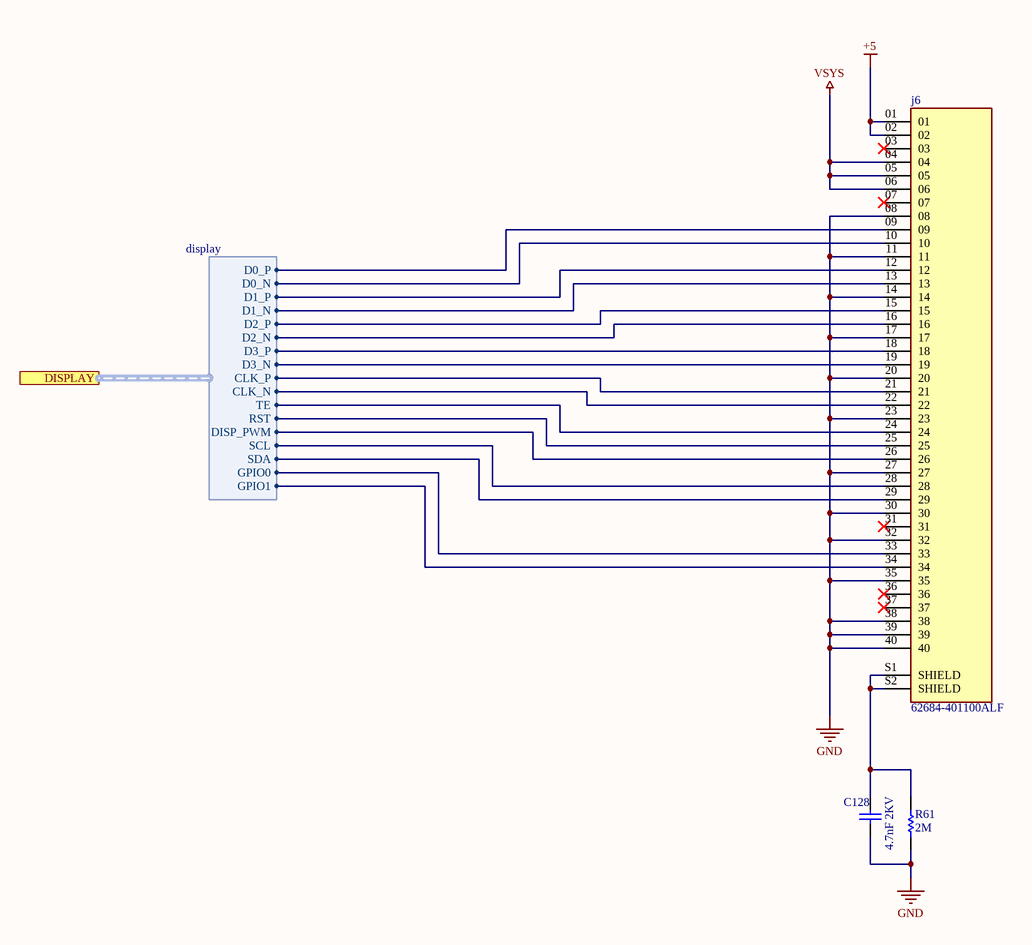
[diagram p32: Display.SchDoc]

### Parts
C128  value 4.7nF 2KV  [C1210]  (hidden comment: C1210)
j6  62684-401100ALF  [AMPHENOL_62684-401100ALF]
R61  value 2M  [R0603]  (hidden comment: R0603)

### Ports
DISPLAY (harness display, see main[9100,8000], MT8365[6900,9000], MT8365_CONN[1400,3100])

### Harnesses
display: D0_P, D0_N, D1_P, D1_N, D2_P, D2_N, D3_P, D3_N, CLK_P, CLK_N, TE, RST, DISP_PWM, SCL, SDA, GPIO0, GPIO1

### Nets
+5: j6.01 j6.02
GND: C128.1 j6.08 j6.11 j6.14 j6.17 j6.20 j6.23 j6.27 j6.30 j6.32 j6.35 j6.38 j6.39 j6.40 R61.2
VSYS: j6.04 j6.05 j6.06
3: j6.29 ; port DISPLAY.SDA
5: j6.28 ; port DISPLAY.SCL
DSI_CK_N: j6.22 ; port DISPLAY.CLK_N
DSI_CK_P: j6.21 ; port DISPLAY.CLK_P
DSI_D0_N: j6.10 ; port DISPLAY.D0_N
DSI_D0_P: j6.09 ; port DISPLAY.D0_P
DSI_D1_N: j6.13 ; port DISPLAY.D1_N
DSI_D1_P: j6.12 ; port DISPLAY.D1_P
DSI_D2_N: j6.16 ; port DISPLAY.D2_N
DSI_D2_P: j6.15 ; port DISPLAY.D2_P
DSI_D3_N: j6.19 ; port DISPLAY.D3_N
DSI_D3_P: j6.18 ; port DISPLAY.D3_P
GPIO17: j6.33 ; port DISPLAY.GPIO0
GPIO18: j6.34 ; port DISPLAY.GPIO1
NetC128_2: C128.2 j6.S1(SHIELD) j6.S2(SHIELD) R61.1
Netj6_24: j6.24 ; port DISPLAY.TE
Netj6_25: j6.25 ; port DISPLAY.RST
Netj6_26: j6.26 ; port DISPLAY.DISP_PWM

Not connected (* = marked no-connect by the designer): j6 03* 07* 31* 36* 37*

## Sheet AUDIO_AMP.SchDoc
size A4; SheetNumber: 34; SheetTotal: 35
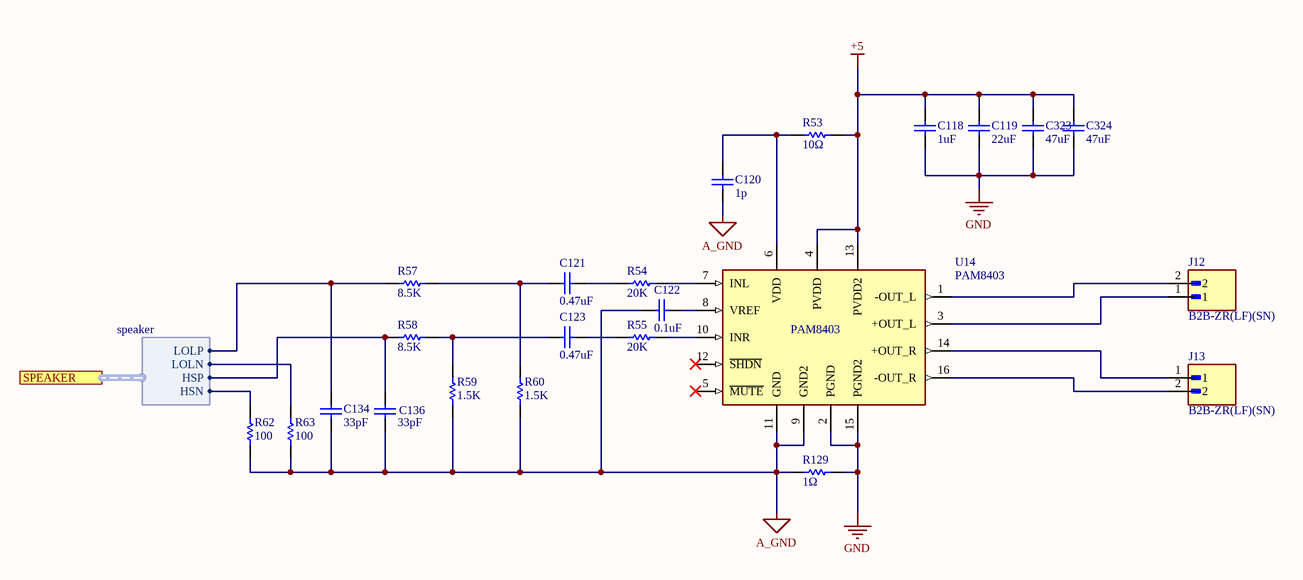
[diagram p33: AUDIO_AMP.SchDoc]

### Parts
C118  value 1uF  [C0805]  (hidden comment: C0805)
C119  value 22uF  [C1210]  (hidden comment: C1210)
C120  value 1p  [C0402]  (hidden comment: C0402)
C121  value 0.47uF  [C0603]  (hidden comment: C0603)
C122  value 0.1uF  [C0603]  (hidden comment: C0603)
C123  value 0.47uF  [C0603]  (hidden comment: C0603)
C134  value 33pF  [C0402]  (hidden comment: C0402)
C136  value 33pF  [C0402]  (hidden comment: C0402)
C323  value 47uF  [C1812]  (hidden comment: C1812)
C324  value 47uF  [C1812]  (hidden comment: C1812)
J12  B2B-ZR(LF)(SN)  [JST_B2B-ZR(LF)(SN)]
J13  B2B-ZR(LF)(SN)  [JST_B2B-ZR(LF)(SN)]
R53  value 10Ω  [R0603]  (hidden comment: R0603)
R54  value 20K  [R0603]  (hidden comment: R0603)
R55  value 20K  [R0603]  (hidden comment: R0603)
R57  value 8.5K  [R0603]  (hidden comment: R0603)
R58  value 8.5K  [R0603]  (hidden comment: R0603)
R59  value 1.5K  [R0603]  (hidden comment: R0603)
R60  value 1.5K  [R0603]  (hidden comment: R0603)
R62  value 100  [R0603]  (hidden comment: R0603)
R63  value 100  [R0603]  (hidden comment: R0603)
R129  value 1Ω  [R0603]  (hidden comment: R0603)
U14  PAM8403  [SOP-16]

### Ports
SPEAKER (harness speaker, see main[4000,1100], AU[14100,7200], Power[5800,3800])

### Harnesses
speaker: LOLP, LOLN, HSP, HSN

### Nets
+5: C118.1 C119.2 C323.2 C324.2 R53.2 U14.4(PVDD) U14.13(PVDD2)
A_GND: C120.1 C122.2 C134.1 C136.1 R59.1 R60.1 R62.1 R63.1 R129.1 U14.9(GND2) U14.11(GND)
GND: C118.2 C119.1 C323.1 C324.1 R129.2 U14.2(PGND) U14.15(PGND2)
HS_N: R62.2 ; port SPEAKER.HSN
HS_P: C136.2 R58.1 ; port SPEAKER.HSP
LOL_N: R63.2 ; port SPEAKER.LOLN
LOL_P: C134.2 R57.1 ; port SPEAKER.LOLP
NetC120_2: C120.2 R53.1 U14.6(VDD)
NetC121_1: C121.1 R54.1
NetC121_2: C121.2 R57.2 R60.2
NetC122_1: C122.1 U14.8(VREF)
NetC123_1: C123.1 R55.1
NetC123_2: C123.2 R58.2 R59.2
NetJ12_1: J12.1 U14.3(+OUT_L)
NetJ12_2: J12.2 U14.1(-OUT_L)
NetJ13_1: J13.1 U14.14(+OUT_R)
NetJ13_2: J13.2 U14.16(-OUT_R)
NetR54_2: R54.2 U14.7(INL)
NetR55_2: R55.2 U14.10(INR)

Not connected (* = marked no-connect by the designer): U14 5(~{MUTE})* 12(~{SHDN})*

### Library data of the parts
J12 J13 = B2B-ZR(LF)(SN): Connector Header Through Hole 2 position 0.059 (1.50mm)
U14 = PAM8403: Audio Amp Speaker 2-CH Stereo 3.2W Class-D 16-Pin SOP T/R

## Sheet I2C_Switch.SchDoc
size A3; SheetNumber: 35; SheetTotal: 35
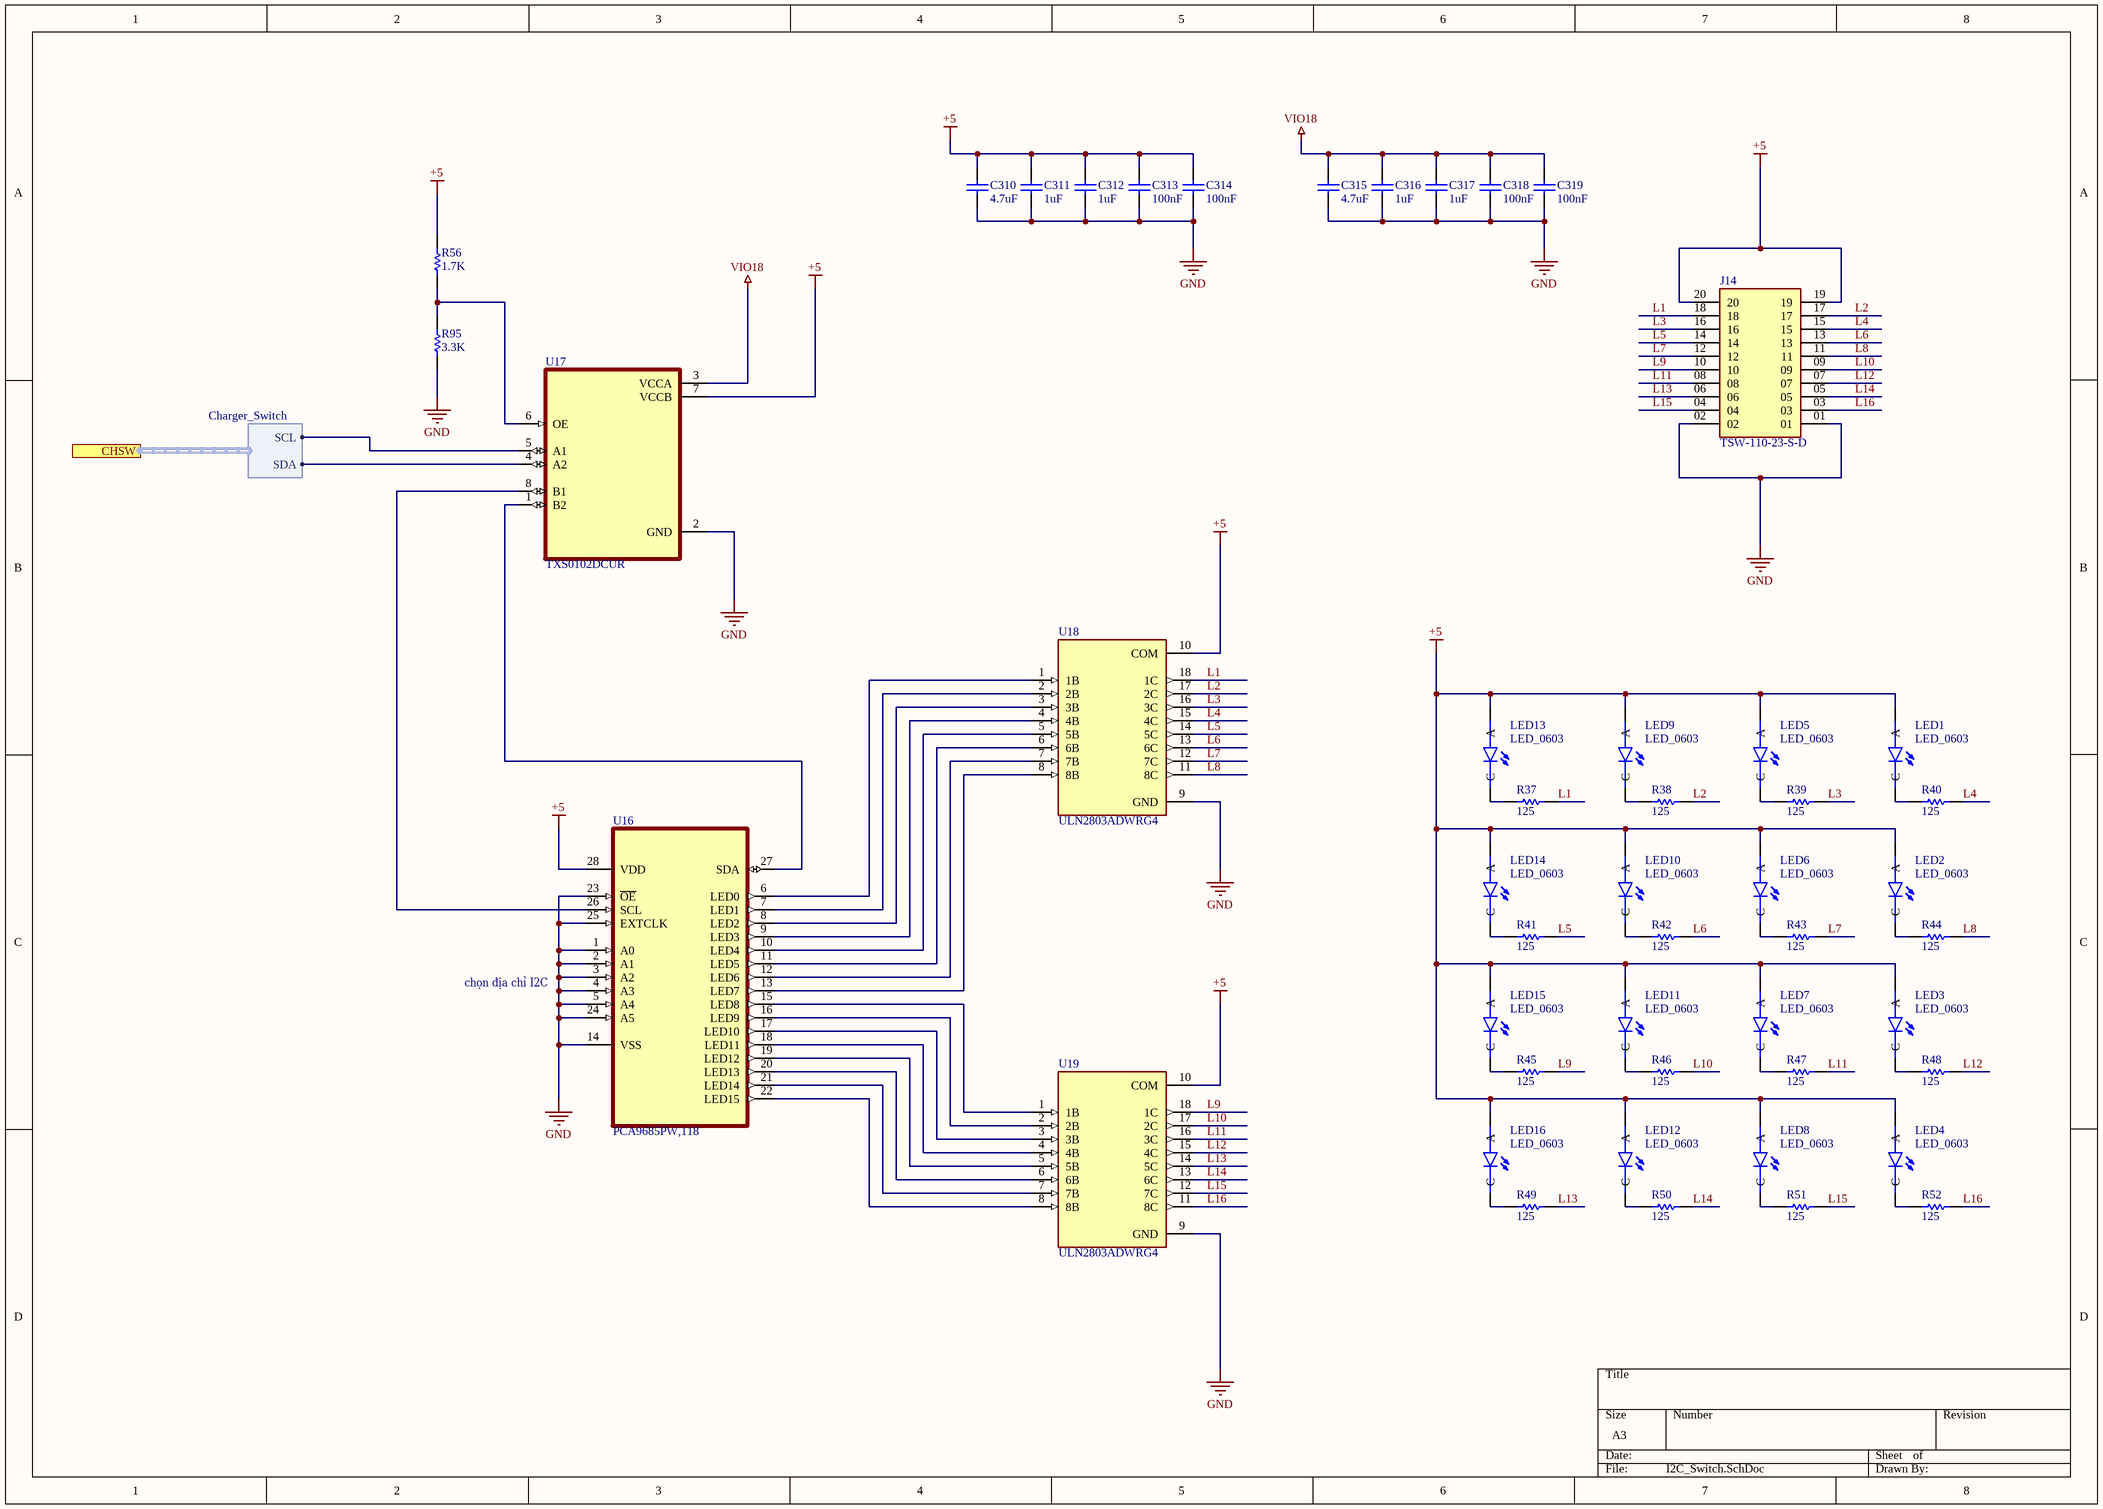
[diagram p34: I2C_Switch.SchDoc]

### Parts
C310  value 4.7uF  [C0805]  (hidden comment: C0805)
C311  value 1uF  [C0805]  (hidden comment: C0805)
C312  value 1uF  [C0805]  (hidden comment: C0805)
C313  value 100nF  [C0603]  (hidden comment: C0603)
C314  value 100nF  [C0603]  (hidden comment: C0603)
C315  value 4.7uF  [C0805]  (hidden comment: C0805)
C316  value 1uF  [C0805]  (hidden comment: C0805)
C317  value 1uF  [C0805]  (hidden comment: C0805)
C318  value 100nF  [C0603]  (hidden comment: C0603)
C319  value 100nF  [C0603]  (hidden comment: C0603)
J14  TSW-110-23-S-D  [SAMTEC_TSW-110-23-S-D]
LED1  LED_0603  [LED_0603]
LED2  LED_0603  [LED_0603]
LED3  LED_0603  [LED_0603]
LED4  LED_0603  [LED_0603]
LED5  LED_0603  [LED_0603]
LED6  LED_0603  [LED_0603]
LED7  LED_0603  [LED_0603]
LED8  LED_0603  [LED_0603]
LED9  LED_0603  [LED_0603]
LED10  LED_0603  [LED_0603]
LED11  LED_0603  [LED_0603]
LED12  LED_0603  [LED_0603]
LED13  LED_0603  [LED_0603]
LED14  LED_0603  [LED_0603]
LED15  LED_0603  [LED_0603]
LED16  LED_0603  [LED_0603]
R37  value 125  [R0603]  (hidden comment: R0603)
R38  value 125  [R0603]  (hidden comment: R0603)
R39  value 125  [R0603]  (hidden comment: R0603)
R40  value 125  [R0603]  (hidden comment: R0603)
R41  value 125  [R0603]  (hidden comment: R0603)
R42  value 125  [R0603]  (hidden comment: R0603)
R43  value 125  [R0603]  (hidden comment: R0603)
R44  value 125  [R0603]  (hidden comment: R0603)
R45  value 125  [R0603]  (hidden comment: R0603)
R46  value 125  [R0603]  (hidden comment: R0603)
R47  value 125  [R0603]  (hidden comment: R0603)
R48  value 125  [R0603]  (hidden comment: R0603)
R49  value 125  [R0603]  (hidden comment: R0603)
R50  value 125  [R0603]  (hidden comment: R0603)
R51  value 125  [R0603]  (hidden comment: R0603)
R52  value 125  [R0603]  (hidden comment: R0603)
R56  value 1.7K  [R0603]  (hidden comment: R0603)
R95  value 3.3K  [R0603]  (hidden comment: R0603)
U16  PCA9685PW,118  [SOP65P640X110-28N]
U17  TXS0102DCUR  [SOP50P310X90-8N]
U18  ULN2803ADWRG4  [SOIC127P1030X265-18N]
U19  ULN2803ADWRG4  [SOIC127P1030X265-18N]

### Ports
CHSW (harness Charger_Switch, see main[8500,1000], Charger_boost_LDO[1400,3400], Power[5300,500])

### Harnesses
Charger_Switch: SCL, SDA

### Nets
+5: C310.2 C311.2 C312.2 C313.2 C314.2 J14.19 J14.20 LED1.A LED2.A LED3.A LED4.A LED5.A LED6.A LED7.A LED8.A LED9.A LED10.A LED11.A LED12.A LED13.A LED14.A LED15.A LED16.A R56.2 U16.28(VDD) U17.7(VCCB) U18.10(COM) U19.10(COM)
GND: C310.1 C311.1 C312.1 C313.1 C314.1 C315.1 C316.1 C317.1 C318.1 C319.1 J14.01 J14.02 R95.1 U16.1(A0) U16.2(A1) U16.3(A2) U16.4(A3) U16.5(A4) U16.14(VSS) U16.23(~{OE}) U16.24(A5) U16.25(EXTCLK) U17.2(GND) U18.9(GND) U19.9(GND)
VIO18: C315.2 C316.2 C317.2 C318.2 C319.2 U17.3(VCCA)
L1: J14.18 R37.2 U18.18(1C)
L2: J14.17 R38.2 U18.17(2C)
L3: J14.16 R39.2 U18.16(3C)
L4: J14.15 R40.2 U18.15(4C)
L5: J14.14 R41.2 U18.14(5C)
L6: J14.13 R42.2 U18.13(6C)
L7: J14.12 R43.2 U18.12(7C)
L8: J14.11 R44.2 U18.11(8C)
L9: J14.10 R45.2 U19.18(1C)
L10: J14.09 R46.2 U19.17(2C)
L11: J14.08 R47.2 U19.16(3C)
L12: J14.07 R48.2 U19.15(4C)
L13: J14.06 R49.2 U19.14(5C)
L14: J14.05 R50.2 U19.13(6C)
L15: J14.04 R51.2 U19.12(7C)
L16: J14.03 R52.2 U19.11(8C)
NetLED1_C: LED1.C R40.1
NetLED2_C: LED2.C R44.1
NetLED3_C: LED3.C R48.1
NetLED4_C: LED4.C R52.1
NetLED5_C: LED5.C R39.1
NetLED6_C: LED6.C R43.1
NetLED7_C: LED7.C R47.1
NetLED8_C: LED8.C R51.1
NetLED9_C: LED9.C R38.1
NetLED10_C: LED10.C R42.1
NetLED11_C: LED11.C R46.1
NetLED12_C: LED12.C R50.1
NetLED13_C: LED13.C R37.1
NetLED14_C: LED14.C R41.1
NetLED15_C: LED15.C R45.1
NetLED16_C: LED16.C R49.1
NetR35_1: U17.5(A1) ; port CHSW.SCL
NetR36_1: U17.4(A2) ; port CHSW.SDA
NetR56_1: R56.1 R95.2 U17.6(OE)
NetU16_6: U16.6(LED0) U18.1(1B)
NetU16_7: U16.7(LED1) U18.2(2B)
NetU16_8: U16.8(LED2) U18.3(3B)
NetU16_9: U16.9(LED3) U18.4(4B)
NetU16_10: U16.10(LED4) U18.5(5B)
NetU16_11: U16.11(LED5) U18.6(6B)
NetU16_12: U16.12(LED6) U18.7(7B)
NetU16_13: U16.13(LED7) U18.8(8B)
NetU16_15: U16.15(LED8) U19.1(1B)
NetU16_16: U16.16(LED9) U19.2(2B)
NetU16_17: U16.17(LED10) U19.3(3B)
NetU16_18: U16.18(LED11) U19.4(4B)
NetU16_19: U16.19(LED12) U19.5(5B)
NetU16_20: U16.20(LED13) U19.6(6B)
NetU16_21: U16.21(LED14) U19.7(7B)
NetU16_22: U16.22(LED15) U19.8(8B)
NetU16_26: U16.26(SCL) U17.8(B1)
NetU16_27: U16.27(SDA) U17.1(B2)

### Notes on the sheet
- (near U16) chọn địa chỉ I2C

### Library data of the parts
J14 = TSW-110-23-S-D: TSW Series .100 Terminal Strip
LED1-LED16 = LED_0603: LED SMD
U16 = PCA9685PW,118: LED Driver IC 16 Output Linear - PWM Dimming 25mA 28-TSSOP
U18 U19 = ULN2803ADWRG4: 50-V, 8-ch darlington array 18-SOIC -40 to 85

## Nets that join several sheets
3.3: RTL8201F (5 pins), Charger_boost_LDO (C116.2 U15.5 U21.7), GPIOs (13 pins)
+5: Charger_boost_LDO (5 pins), USB (ESD15.1 J5.1), GPIOs (J7.2 J7.4), Display (j6.01 j6.02), AUDIO_AMP (7 pins), I2C_Switch (28 pins)
AAVDD18_GPS: MT6631 (9 pins), LDO (C81.2 U4.F6)
AVDD33_WBT: MT6631 (C210.2 C211.2 C292.2 U6.33), LDO (C83.2 U4.N12)
DVDD_DVFS: MT8365_Power (40 pins), BUCK (Q2.2 SJ2.1)
DVDD_TOP: MT8365_Power (46 pins), BUCK (Q1.2 SJ1.1)
GND: MT8365_LPDDR4X (R86.2), MT8365_Ground (247 pins), MT8365_Power (79 pins), MT8365_AUD (9 pins), MT8365_Other (8 pins), LPDDR4X_Power (20 pins), LPDDR4X_Ground (58 pins), eMMC (19 pins), MT6631 (FB4.1), JTAG_Connector (9 pins), UART (29 pins), RTL8201F (23 pins), Power (9 pins), Power_Supply (56 pins), BUCK (22 pins), LDO (30 pins), AU (18 pins), RTC_Miscellaneous (5 pins), Control_Interface (7 pins), Charger_boost_LDO (20 pins), Camera (20 pins), USB (13 pins), GPIOs (26 pins), Display (15 pins), AUDIO_AMP (7 pins), I2C_Switch (25 pins)
ODT_CA_a: MT8365_Power (11 pins), LPDDR4X_Channel_A (U2.G2), LPDDR4X_Channel_B (U2.T2), LPDDR4X_Power (33 pins), BUCK (5 pins), LDO (C203.2 C204.2 U4.R15)
VA12_PMU: MT8365_Power (6 pins), LDO (U4.N16)
VCN28: MT6631 (C213.2 FL7.1 L12.1), LDO (C82.2 U4.R6)
VDRAM2: MT8365_Power (8 pins), LPDDR4X_Power (26 pins), LPDDR4X_other (R84.1 R85.1), BUCK (C75.2 U4.P15)
VEFUSE_PMU: MT8365_Power (C278.2 U1#2.AB22), LDO (U4.E3)
VEMC: eMMC (7 pins), LDO (C80.2 R121.2 U4.R11)
VIO18: MT8365_Power (30 pins), MT8365_AUD (SW4.3 SW4.4 SW5.3 SW5.4), LPDDR4X_Power (13 pins), eMMC (8 pins), JTAG_Connector (J8.1 J8.2), UART (R17.1), LDO (15 pins), AU (R7.2), Charger_boost_LDO (U21.3 U21.6), Camera (6 pins), GPIOs (12 pins), I2C_Switch (6 pins)
VIO18_PMU: MT8365_AUD (MK2.1 MK3.1 MK3.2), LDO (C133.2 U4.H2)
VMC: MT8365_Power (C279.2 U1#2.L1), LDO (C202.2 U4.R9)
VS1: BUCK (C69.2 L5.2 R115.2 U4.E7), LDO (C199.2 C200.2 C201.2 U4.E4)
VS2: BUCK (L7.2 U4.D16), LDO (5 pins)
VSRAM_OTHERS: MT8365_Power (C274.2 C275.2 U1#2.V19), BUCK (C78.2 U4.P14)
VSRAM_PROC11: MT8365_Power (C276.2 C277.2 U1#2.T9 U1#2.U19), BUCK (C76.2 U4.P12)
VSYS: Power (ESD1.1 J9.1), Power_Supply (37 pins), BUCK (6 pins), LDO (R122.2 U30.1 U30.5), RTC_Miscellaneous (R9.2), Charger_boost_LDO (8 pins), Camera (6 pins), GPIOs (C130.2 U24.1 U24.3), Display (j6.04 j6.05 j6.06)
VUSB_PMU: MT8365_Power (C280.2 U1#2.W28), LDO (U4.N8)
3: MT8365_CONN (U1#2.AJ24), GPIOs (U13.4), Display (j6.29)
5: MT8365_CONN (U1#2.AH24), GPIOs (U13.5), Display (j6.28)
26M_CLKSQ: MT8365_Other (U1#2.AC20), RTC_Miscellaneous (R11.2)
27: MT8365_CONN (U1#2.AD5), Camera (U20.4), GPIOs (U12.4)
28: MT8365_CONN (U1#2.AC5), Camera (U20.5), GPIOs (U12.5)
BT_CLK: MT8365_CONN (U1#2.AD8), MT6631 (U6.24)
BT_DATA: MT8365_CONN (U1#2.AC8), MT6631 (U6.25)
BT_IN: MT8365_CONN (U1#2.AH9), MT6631 (U6.15)
BT_IP: MT8365_CONN (U1#2.AJ9), MT6631 (U6.16)
BT_QN: MT8365_CONN (U1#2.AH11), MT6631 (U6.13)
BT_QP: MT8365_CONN (U1#2.AH10), MT6631 (U6.14)
CK: MT8365_CONN (U1#2.AF6), GPIOs (U10.6)
CK_c_a: MT8365_LPDDR4X (U1#1.D8), LPDDR4X_Channel_A (U2.J9)
CK_c_b: MT8365_LPDDR4X (U1#1.K18), LPDDR4X_Channel_B (U2.P9)
CK_t_a: MT8365_LPDDR4X (U1#1.E8), LPDDR4X_Channel_A (U2.J8)
CK_t_b: MT8365_LPDDR4X (U1#1.J18), LPDDR4X_Channel_B (U2.P8)
CKE0_a: MT8365_LPDDR4X (U1#1.K14), LPDDR4X_Channel_A (U2.J4)
CKE0_b: MT8365_LPDDR4X (U1#1.D24), LPDDR4X_Channel_B (U2.P4)
CKE1_a: MT8365_LPDDR4X (U1#1.J14), LPDDR4X_Channel_A (U2.J5)
CKE1_b: MT8365_LPDDR4X (U1#1.C24), LPDDR4X_Channel_B (U2.P5)
CLK: MT8365_eMMC (U1#2.M28), eMMC (IC3.M6)
CMD: MT8365_eMMC (U1#2.M26), eMMC (IC3.M5)
CRS/CRS_DV: MT8365_CONN (U1#2.AG21), RTL8201F (U7.26)
CS: MT8365_CONN (U1#2.AE5), GPIOs (U10.7)
CS0_a: MT8365_LPDDR4X (U1#1.G9), LPDDR4X_Channel_A (U2.H4)
CS0_b: MT8365_LPDDR4X (U1#1.F18), LPDDR4X_Channel_B (U2.R4)
CS1_a: MT8365_LPDDR4X (U1#1.F9), LPDDR4X_Channel_A (U2.H3)
CS1_b: MT8365_LPDDR4X (U1#1.G18), LPDDR4X_Channel_B (U2.R3)
CSI0_CLK_N: MT8365_Camera (U1#1.P6), Camera (J4.08)
CSI0_CLK_P: MT8365_Camera (U1#1.P7), Camera (J4.09)
CSI0_L0_N: MT8365_Camera (U1#1.R3), Camera (J4.02)
CSI0_L0_P: MT8365_Camera (U1#1.R4), Camera (J4.03)
CSI0_L1_N: MT8365_Camera (U1#1.P4), Camera (J4.05)
CSI0_L1_P: MT8365_Camera (U1#1.P5), Camera (J4.06)
CSI1_CLK_N: MT8365_Camera (U1#1.R6), Camera (J16.08)
CSI1_CLK_P: MT8365_Camera (U1#1.R7), Camera (J16.09)
CSI1_L0_N: MT8365_Camera (U1#1.U5), Camera (J16.02)
CSI1_L0_P: MT8365_Camera (U1#1.U6), Camera (J16.03)
CSI1_L1_N: MT8365_Camera (U1#1.T3), Camera (J16.05)
CSI1_L1_P: MT8365_Camera (U1#1.T4), Camera (J16.06)
detect: MT8365_CONN (U1#2.V30), USB (R127.1 R128.2)
DMI0_a: MT8365_LPDDR4X (U1#1.C10), LPDDR4X_Channel_A (U2.C3)
DMI0_b: MT8365_LPDDR4X (U1#1.A24), LPDDR4X_Channel_B (U2.Y3)
DMI1_a: MT8365_LPDDR4X (U1#1.B1), LPDDR4X_Channel_A (U2.C10)
DMI1_b: MT8365_LPDDR4X (U1#1.E29), LPDDR4X_Channel_B (U2.Y10)
DQS0_c_a: MT8365_LPDDR4X (U1#1.C7), LPDDR4X_Channel_A (U2.E3)
DQS0_c_b: MT8365_LPDDR4X (U1#1.B23), LPDDR4X_Channel_B (U2.V3)
DQS0_t_a: MT8365_LPDDR4X (U1#1.C6), LPDDR4X_Channel_A (U2.D3)
DQS0_t_b: MT8365_LPDDR4X (U1#1.B22), LPDDR4X_Channel_B (U2.W3)
DQS1_c_a: MT8365_LPDDR4X (U1#1.C2), LPDDR4X_Channel_A (U2.E10)
DQS1_c_b: MT8365_LPDDR4X (U1#1.B29), LPDDR4X_Channel_B (U2.V10)
DQS1_t_a: MT8365_LPDDR4X (U1#1.D2), LPDDR4X_Channel_A (U2.D10)
DQS1_t_b: MT8365_LPDDR4X (U1#1.B28), LPDDR4X_Channel_B (U2.W10)
DSI_CK_N: MT8365_CONN (U1#1.Y3), Display (j6.22)
DSI_CK_P: MT8365_CONN (U1#1.AA3), Display (j6.21)
DSI_D0_N: MT8365_CONN (U1#1.W4), Display (j6.10)
DSI_D0_P: MT8365_CONN (U1#1.W5), Display (j6.09)
DSI_D1_N: MT8365_CONN (U1#1.AA2), Display (j6.13)
DSI_D1_P: MT8365_CONN (U1#1.AB2), Display (j6.12)
DSI_D2_N: MT8365_CONN (U1#1.Y6), Display (j6.16)
DSI_D2_P: MT8365_CONN (U1#1.W6), Display (j6.15)
DSI_D3_N: MT8365_CONN (U1#1.AC2), Display (j6.19)
DSI_D3_P: MT8365_CONN (U1#1.AC3), Display (j6.18)
DSL: MT8365_eMMC (U1#2.N26), eMMC (IC3.H5)
EMI0_A3: MT8365_LPDDR4X (U1#1.J6), LPDDR4X_Channel_A (U2.H11)
EMI0_A4: MT8365_LPDDR4X (U1#1.J12), LPDDR4X_Channel_A (U2.H10)
EMI0_A12: MT8365_LPDDR4X (U1#1.H12), LPDDR4X_Channel_A (U2.H9)
EMI0_ACT_N: MT8365_LPDDR4X (U1#1.F12), LPDDR4X_Channel_A (U2.J2)
EMI0_BA0: MT8365_LPDDR4X (U1#1.K12), LPDDR4X_Channel_A (U2.J11)
EMI0_DQ0: MT8365_LPDDR4X (U1#1.C11), LPDDR4X_Channel_A (U2.E2)
EMI0_DQ1: MT8365_LPDDR4X (U1#1.A2), LPDDR4X_Channel_A (U2.B11)
EMI0_DQ2: MT8365_LPDDR4X (U1#1.B12), LPDDR4X_Channel_A (U2.E4)
EMI0_DQ3: MT8365_LPDDR4X (U1#1.B4), LPDDR4X_Channel_A (U2.E11)
EMI0_DQ4: MT8365_LPDDR4X (U1#1.B11), LPDDR4X_Channel_A (U2.F2)
EMI0_DQ5: MT8365_LPDDR4X (U1#1.B3), LPDDR4X_Channel_A (U2.C11)
EMI0_DQ6: MT8365_LPDDR4X (U1#1.B13), LPDDR4X_Channel_A (U2.F4)
EMI0_DQ7: MT8365_LPDDR4X (U1#1.B5), LPDDR4X_Channel_A (U2.F11)
EMI0_DQ8: MT8365_LPDDR4X (U1#1.B7), LPDDR4X_Channel_A (U2.B4)
EMI0_DQ9: MT8365_LPDDR4X (U1#1.E1), LPDDR4X_Channel_A (U2.F9)
EMI0_DQ10: MT8365_LPDDR4X (U1#1.B8), LPDDR4X_Channel_A (U2.C4)
EMI0_DQ11: MT8365_LPDDR4X (U1#1.F2), LPDDR4X_Channel_A (U2.E9)
EMI0_DQ12: MT8365_LPDDR4X (U1#1.B9), LPDDR4X_Channel_A (U2.B2)
EMI0_DQ13: MT8365_LPDDR4X (U1#1.G2), LPDDR4X_Channel_A (U2.C9)
EMI0_DQ14: MT8365_LPDDR4X (U1#1.C9), LPDDR4X_Channel_A (U2.C2)
EMI0_DQ15: MT8365_LPDDR4X (U1#1.H2), LPDDR4X_Channel_A (U2.B9)
EMI0_ODT: MT8365_LPDDR4X (U1#1.G12), LPDDR4X_Channel_A (U2.H2)
EMI1_A0: MT8365_LPDDR4X (U1#1.J28), LPDDR4X_Channel_B (U2.R11)
EMI1_A1: MT8365_LPDDR4X (U1#1.H20), LPDDR4X_Channel_B (U2.R10)
EMI1_A3: MT8365_LPDDR4X (U1#1.G20), LPDDR4X_Channel_B (U2.R9)
EMI1_A5: MT8365_LPDDR4X (U1#1.J20), LPDDR4X_Channel_B (U2.P11)
EMI1_ACT_N: MT8365_LPDDR4X (U1#1.H24), LPDDR4X_Channel_B (U2.R2)
EMI1_DQ0: MT8365_LPDDR4X (U1#1.E30), LPDDR4X_Channel_B (U2.U9)
EMI1_DQ1: MT8365_LPDDR4X (U1#1.B24), LPDDR4X_Channel_B (U2.Y2)
EMI1_DQ2: MT8365_LPDDR4X (U1#1.G29), LPDDR4X_Channel_B (U2.Y9)
EMI1_DQ3: MT8365_LPDDR4X (U1#1.A26), LPDDR4X_Channel_B (U2.Y4)
EMI1_DQ4: MT8365_LPDDR4X (U1#1.F29), LPDDR4X_Channel_B (U2.V9)
EMI1_DQ5: MT8365_LPDDR4X (U1#1.B25), LPDDR4X_Channel_B (U2.AA2)
EMI1_DQ6: MT8365_LPDDR4X (U1#1.H29), LPDDR4X_Channel_B (U2.AA9)
EMI1_DQ7: MT8365_LPDDR4X (U1#1.A27), LPDDR4X_Channel_B (U2.AA4)
EMI1_DQ8: MT8365_LPDDR4X (U1#1.A29), LPDDR4X_Channel_B (U2.U11)
EMI1_DQ9: MT8365_LPDDR4X (U1#1.A21), LPDDR4X_Channel_B (U2.V2)
EMI1_DQ10: MT8365_LPDDR4X (U1#1.B30), LPDDR4X_Channel_B (U2.V11)
EMI1_DQ11: MT8365_LPDDR4X (U1#1.B20), LPDDR4X_Channel_B (U2.U2)
EMI1_DQ12: MT8365_LPDDR4X (U1#1.C30), LPDDR4X_Channel_B (U2.Y11)
EMI1_DQ13: MT8365_LPDDR4X (U1#1.B19), LPDDR4X_Channel_B (U2.V4)
EMI1_DQ14: MT8365_LPDDR4X (U1#1.D29), LPDDR4X_Channel_B (U2.AA11)
EMI1_DQ15: MT8365_LPDDR4X (U1#1.B18), LPDDR4X_Channel_B (U2.U4)
EMI1_ODT: MT8365_LPDDR4X (U1#1.G24), LPDDR4X_Channel_B (U2.P2)
EN_GPS: MT8365_CONN (U1#2.AF19), MT6631 (U26.5)
EXT_MDC: MT8365_CONN (U1#2.AG17), RTL8201F (U7.22)
EXT_MDIO: MT8365_CONN (U1#2.AF17), RTL8201F (U7.23)
EXT_RXC: MT8365_CONN (U1#2.AF18), RTL8201F (U7.15)
EXT_RXD0: MT8365_CONN (U1#2.AJ19), RTL8201F (U7.9)
EXT_RXD1: MT8365_CONN (U1#2.AG18), RTL8201F (U7.10)
EXT_RXER: MT8365_CONN (U1#2.AH19), RTL8201F (R14.1 U7.28)
EXT_TXD0: MT8365_CONN (U1#2.AE20), RTL8201F (U7.16)
EXT_TXD1: MT8365_CONN (U1#2.AE21), RTL8201F (U7.17)
EXT_TXEN: MT8365_CONN (U1#2.AE17), RTL8201F (U7.20)
GPIO10: MT8365_CONN (U1#2.AJ18), GPIOs (U9.1)
GPIO13: MT8365_CONN (U1#2.AE16), GPIOs (U9.5)
GPIO17: MT8365_CONN (U1#2.AH16), Display (j6.33)
GPIO18: MT8365_CONN (U1#2.AJ16), Display (j6.34)
GPS_I: MT8365_CONN (U1#2.AJ11), MT6631 (U6.12)
GPS_Q: MT8365_CONN (U1#2.AH12), MT6631 (U6.10)
HRST_B: MT8365_CONN (U1#2.AC9), MT6631 (U6.2)
HS_N: AU (U4.H6), AUDIO_AMP (R62.2)
HS_P: AU (U4.J6), AUDIO_AMP (C136.2 R58.1)
JTCK: MT8365_Other (U1#2.AJ15), JTAG_Connector (J8.9)
JTDI: MT8365_Other (U1#2.AH15), JTAG_Connector (J8.5)
JTDO: MT8365_Other (U1#2.AE15), JTAG_Connector (J8.13)
JTMS: MT8365_Other (U1#2.AG15), JTAG_Connector (J8.7)
JTRST: MT8365_Other (U1#2.AG14), JTAG_Connector (J8.15)
KPCOL0: MT8365_CONN (U1#2.AA24), GPIOs (U10.8)
KPCOL1: MT8365_CONN (U1#2.AC24), GPIOs (U10.9)
KPROW0: MT8365_CONN (U1#2.AD24), GPIOs (U11.6)
KPROW1: MT8365_CONN (U1#2.AB24), GPIOs (U11.7)
LOL_N: AU (U4.G6), AUDIO_AMP (R63.2)
LOL_P: AU (U4.G5), AUDIO_AMP (C134.2 R57.1)
MI: MT8365_CONN (U1#2.AE6), GPIOs (U10.4)
MO: MT8365_CONN (U1#2.AG5), GPIOs (U10.3)
NetC109_2: Power (ESD2.1 ESD3.1 J15.1), Charger_boost_LDO (C109.2 IC1.1 R31.2)
NetIC3_A3: MT8365_eMMC (U1#2.L28), eMMC (IC3.A3)
NetIC3_A4: MT8365_eMMC (U1#2.M29), eMMC (IC3.A4)
NetIC3_A5: MT8365_eMMC (U1#2.L29), eMMC (IC3.A5)
NetIC3_B2: MT8365_eMMC (U1#2.L27), eMMC (IC3.B2)
NetIC3_B3: MT8365_eMMC (U1#2.N29), eMMC (IC3.B3)
NetIC3_B4: MT8365_eMMC (U1#2.L30), eMMC (IC3.B4)
NetIC3_B5: MT8365_eMMC (U1#2.N30), eMMC (IC3.B5)
NetIC3_B6: MT8365_eMMC (U1#2.P30), eMMC (IC3.B6)
Netj6_24: MT8365_CONN (U1#1.AA5), Display (j6.24)
Netj6_25: MT8365_CONN (U1#1.AB4), Display (j6.25)
Netj6_26: MT8365_CONN (U1#1.AB5), Display (j6.26)
NetR35_1: MT8365_CONN (U1#2.AH26), Charger_boost_LDO (R35.1), I2C_Switch (U17.5)
NetR36_1: MT8365_CONN (U1#2.AH27), Charger_boost_LDO (R36.1), I2C_Switch (U17.4)
NetU1#1_AA26: MT8365_AUD (U1#1.AA26), AU (U4.J9)
NetU1#1_AA29: MT8365_AUD (U1#1.AA29), AU (U4.J10)
NetU1#1_AB13: MT8365_AUD (U1#1.AB13), GPIOs (U9.6)
NetU1#1_AB14: MT8365_AUD (U1#1.AB14), GPIOs (U11.5)
NetU1#1_AB29: MT8365_AUD (U1#1.AB29), AU (U4.H11)
NetU1#1_AC14: MT8365_AUD (U1#1.AC14), GPIOs (U11.9)
NetU1#1_AD14: MT8365_AUD (U1#1.AD14), GPIOs (U11.8)
NetU1#1_F14: MT8365_LPDDR4X (U1#1.F14), LPDDR4X_other (U2.T11)
NetU1#1_W26: MT8365_AUD (U1#1.W26), AU (U4.L10)
NetU1#1_Y26: MT8365_AUD (U1#1.Y26), AU (U4.L11)
NetU1#1_Y27: MT8365_AUD (U1#1.Y27), AU (U4.K10)
NetU1#1_Y29: MT8365_AUD (U1#1.Y29), AU (U4.J11)
NetU1#1_Y30: MT8365_AUD (U1#1.Y30), AU (U4.H10)
NetU1#2_AC13: MT8365_eMMC (U1#2.AC13), GPIOs (U11.4)
NetU1#2_AC27: MT8365_CONN (U1#2.AC27), Control_Interface (U4.G10)
NetU1#2_AD13: MT8365_eMMC (U1#2.AD13), GPIOs (U9.9)
NetU1#2_AD27: MT8365_CONN (U1#2.AD27), Control_Interface (U4.F11)
NetU1#2_AD28: MT8365_CONN (U1#2.AD28), Control_Interface (U4.F13)
NetU1#2_AE13: MT8365_eMMC (U1#2.AE13), GPIOs (U10.5)
NetU1#2_AE14: MT8365_eMMC (U1#2.AE14), GPIOs (U11.1)
NetU1#2_AE28: MT8365_CONN (U1#2.AE28), Control_Interface (U4.G11)
NetU1#2_AF12: MT8365_eMMC (U1#2.AF12), GPIOs (U10.1)
NetU1#2_AF13: MT8365_eMMC (U1#2.AF13), GPIOs (U9.8)
NetU1#2_AF14: MT8365_eMMC (U1#2.AF14), GPIOs (U9.7)
NetU1#2_AF22: MT8365_CONN (U1#2.AF22), UART (U5.1)
NetU1#2_AF23: MT8365_CONN (U1#2.AF23), UART (U5.5)
NetU1#2_AH4: MT8365_CONN (U1#2.AH4), Camera (U8.5)
NetU1#2_AH22: MT8365_CONN (U1#2.AH22), UART (U3.1)
NetU1#2_AH23: MT8365_CONN (U1#2.AH23), UART (U3.5)
NetU1#2_AJ4: MT8365_CONN (U1#2.AJ4), Camera (U8.4)
PWM_C: MT8365_CONN (U1#2.AF21), GPIOs (U11.3)
reset: MT8365_Other (U1#2.AC30), UART (U3.19 U5.19), RTL8201F (R16.2), Control_Interface (R126.2 U4.D4)
RSTB: MT8365_eMMC (U1#2.M27), eMMC (IC3.K5)
RTC: MT8365_Other (U1#2.Y28), RTC_Miscellaneous (U4.F10)
SRCLKEN_IN0: MT8365_Other (U1#2.AB27), Control_Interface (U4.L7)
SRCLKEN_IN1: MT8365_Other (U1#2.AB28), Control_Interface (U4.J7)
TOP_CLK: MT8365_CONN (U1#2.AE9), MT6631 (U6.4)
TOP_DATA: MT8365_CONN (U1#2.AD9), MT6631 (U6.3)
URXD2: MT8365_CONN (U1#2.AE24), GPIOs (U9.4)
USB0_N: MT8365_CONN (R27.1), USB (ESD4.2 J1.2)
USB0_P: MT8365_CONN (R26.1), USB (ESD4.1 J1.3)
USB1_N: MT8365_CONN (R29.1), USB (ESD.2 J5.2)
USB1_P: MT8365_CONN (R28.1), USB (ESD.1 J5.3)
UTXD2: MT8365_CONN (U1#2.AE23), GPIOs (U9.3)
VIO_18: BUCK (R117.2), LDO (C84.2 Q3.3 SJ3.2 U4.F3)
WATCHDOG: MT8365_Other (U1#2.AB30), Control_Interface (U4.F12)
WB_PTA: MT8365_CONN (U1#2.AB9), MT6631 (U6.5)
WF_CTRL0: MT8365_CONN (U1#2.AE8), MT6631 (U6.23)
WF_CTRL1: MT8365_CONN (U1#2.AF7), MT6631 (U6.22)
WF_CTRL2: MT8365_CONN (U1#2.AB8), MT6631 (U6.21)
WF_IN: MT8365_CONN (U1#2.AJ7), MT6631 (U6.19)
WF_IP: MT8365_CONN (U1#2.AJ6), MT6631 (U6.20)
WF_QN: MT8365_CONN (U1#2.AH8), MT6631 (U6.17)
WF_QP: MT8365_CONN (U1#2.AH7), MT6631 (U6.18)
XO_IN: MT8365_Other (R12.1), MT6631 (U6.8), RTC_Miscellaneous (R10.2)